# EAGLE design IO4-IR-Detector-GBunza-Fingers (EAGLE 7.7.0)

## Sheet 1 of 16
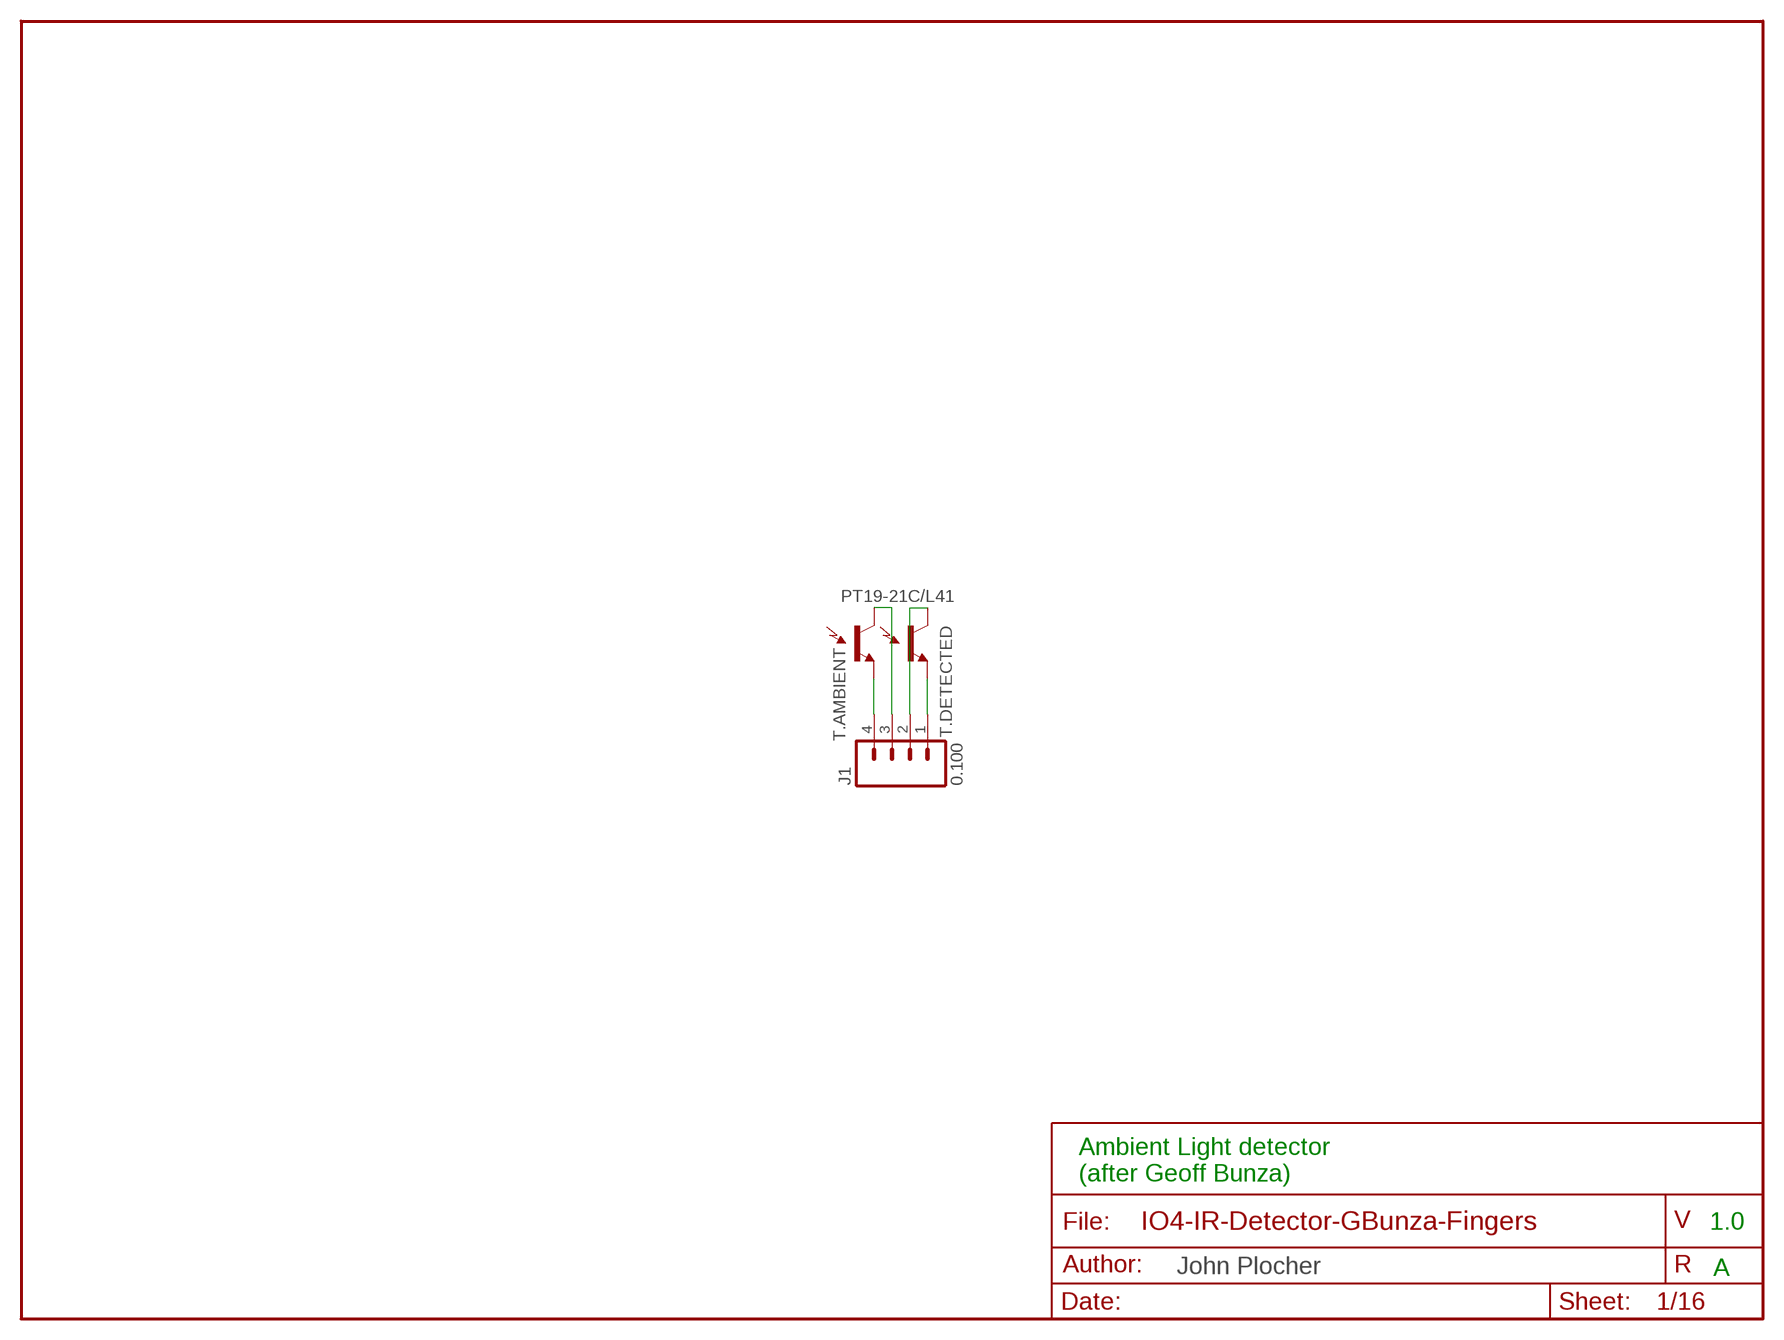
[diagram p0: schematic, sheet 1]

### Parts
J1  0.100  CONNECTOR-M04LOCK  [1X04_LOCK]
T.AMBIENT  PT19-21C/L41  LIGHTSENSORALS  [ALS-PT19]
T.DETECTED  PT19-21C/L41  LIGHTSENSORALS  [ALS-PT19]

### Nets
N$13: J1.4 T.AMBIENT.E(E1)
N$14: J1.1 T.DETECTED.E(E1)
N$15: J1.2 T.DETECTED.C(C1)
N$16: J1.3 T.AMBIENT.C(C1)

### Notes on the sheet
- Ambient Light detector
  (after Geoff Bunza)
- 1.0
- A

## Sheet 2 of 16
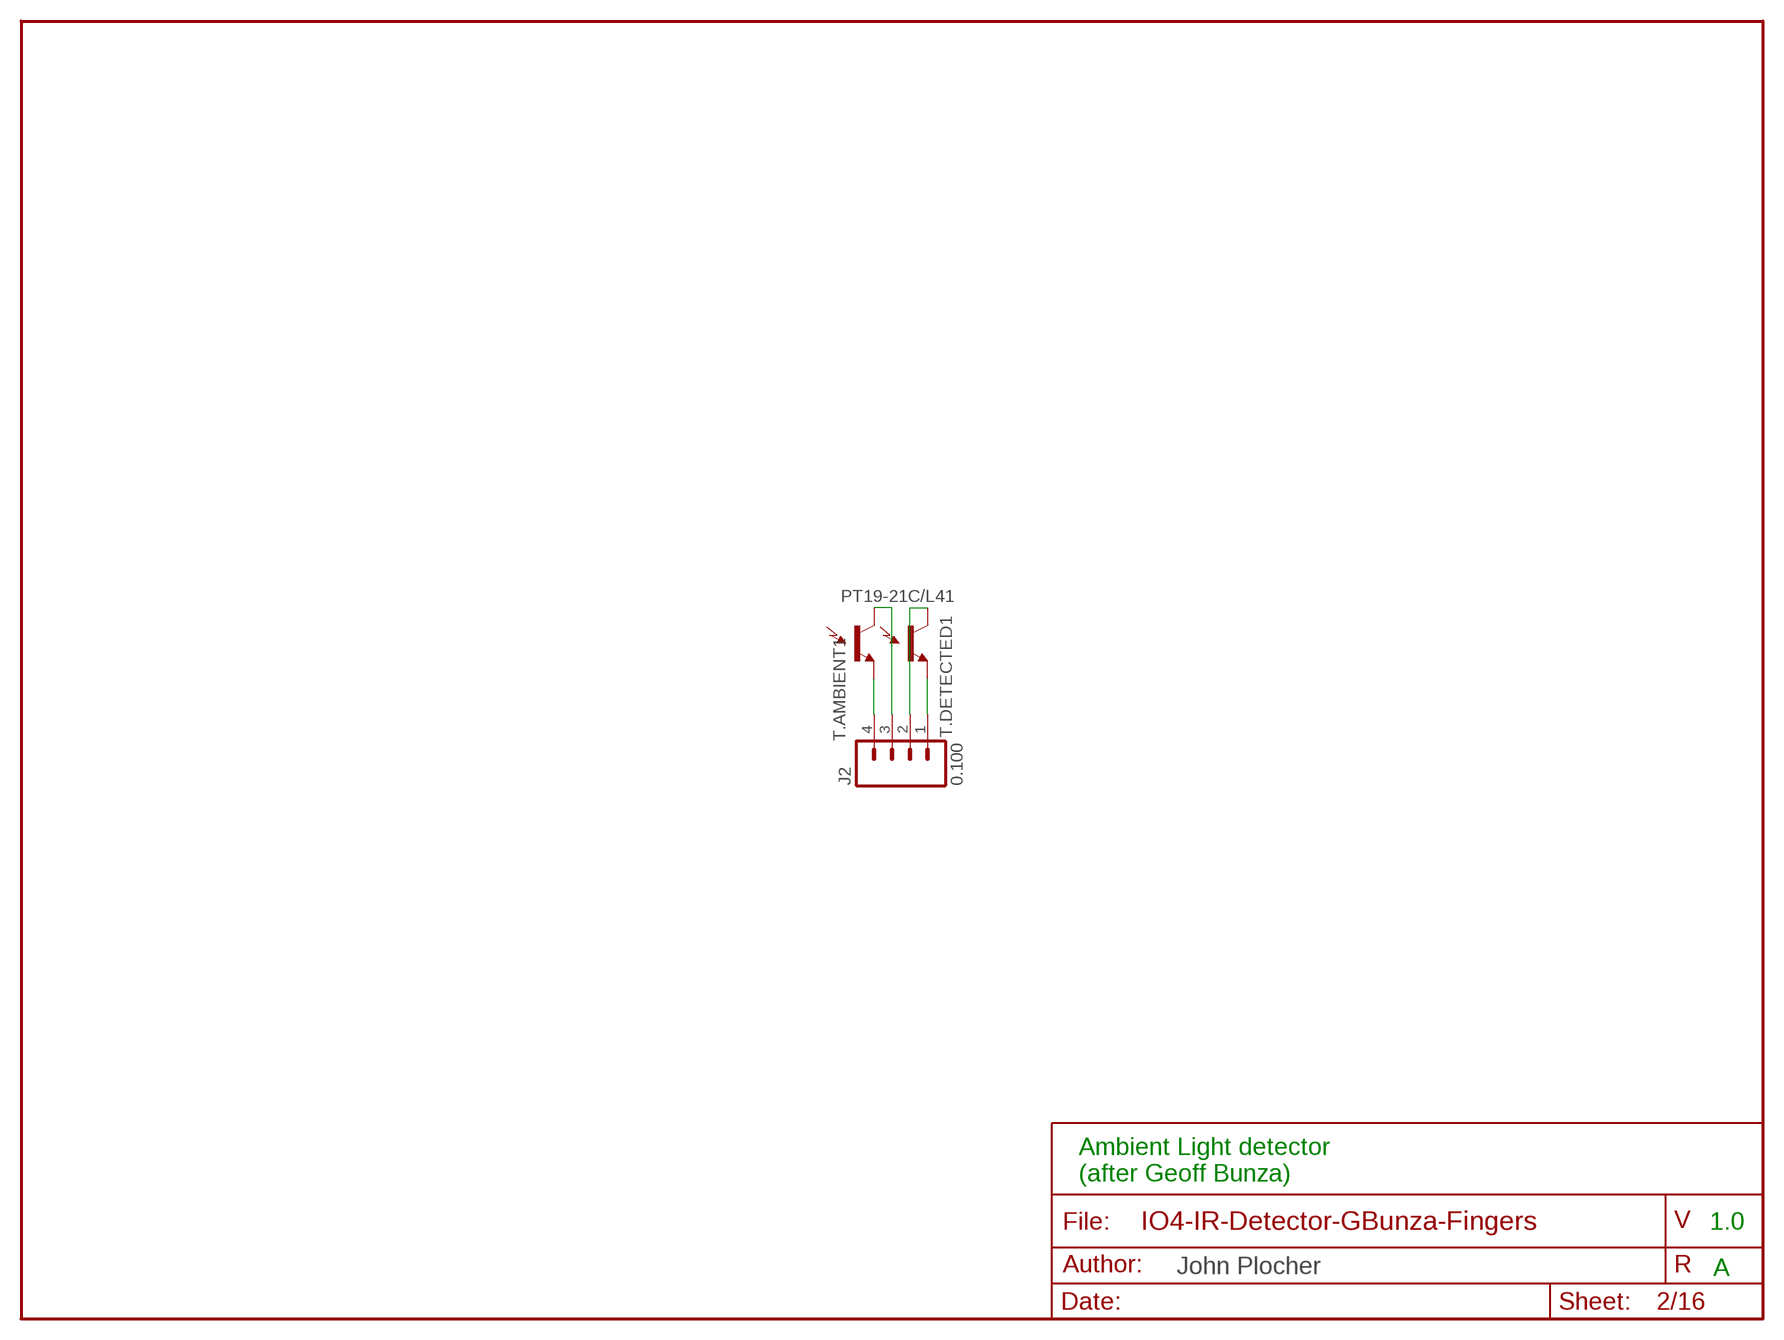
[diagram p1: schematic, sheet 2]

### Parts
J2  0.100  CONNECTOR-M04LOCK  [1X04_LOCK]
T.AMBIENT1  PT19-21C/L41  LIGHTSENSORALS  [ALS-PT19]
T.DETECTED1  PT19-21C/L41  LIGHTSENSORALS  [ALS-PT19]

### Nets
N$1: J2.4 T.AMBIENT1.E(E1)
N$2: J2.1 T.DETECTED1.E(E1)
N$3: J2.2 T.DETECTED1.C(C1)
N$4: J2.3 T.AMBIENT1.C(C1)

### Notes on the sheet
- Ambient Light detector
  (after Geoff Bunza)
- 1.0
- A

## Sheet 3 of 16
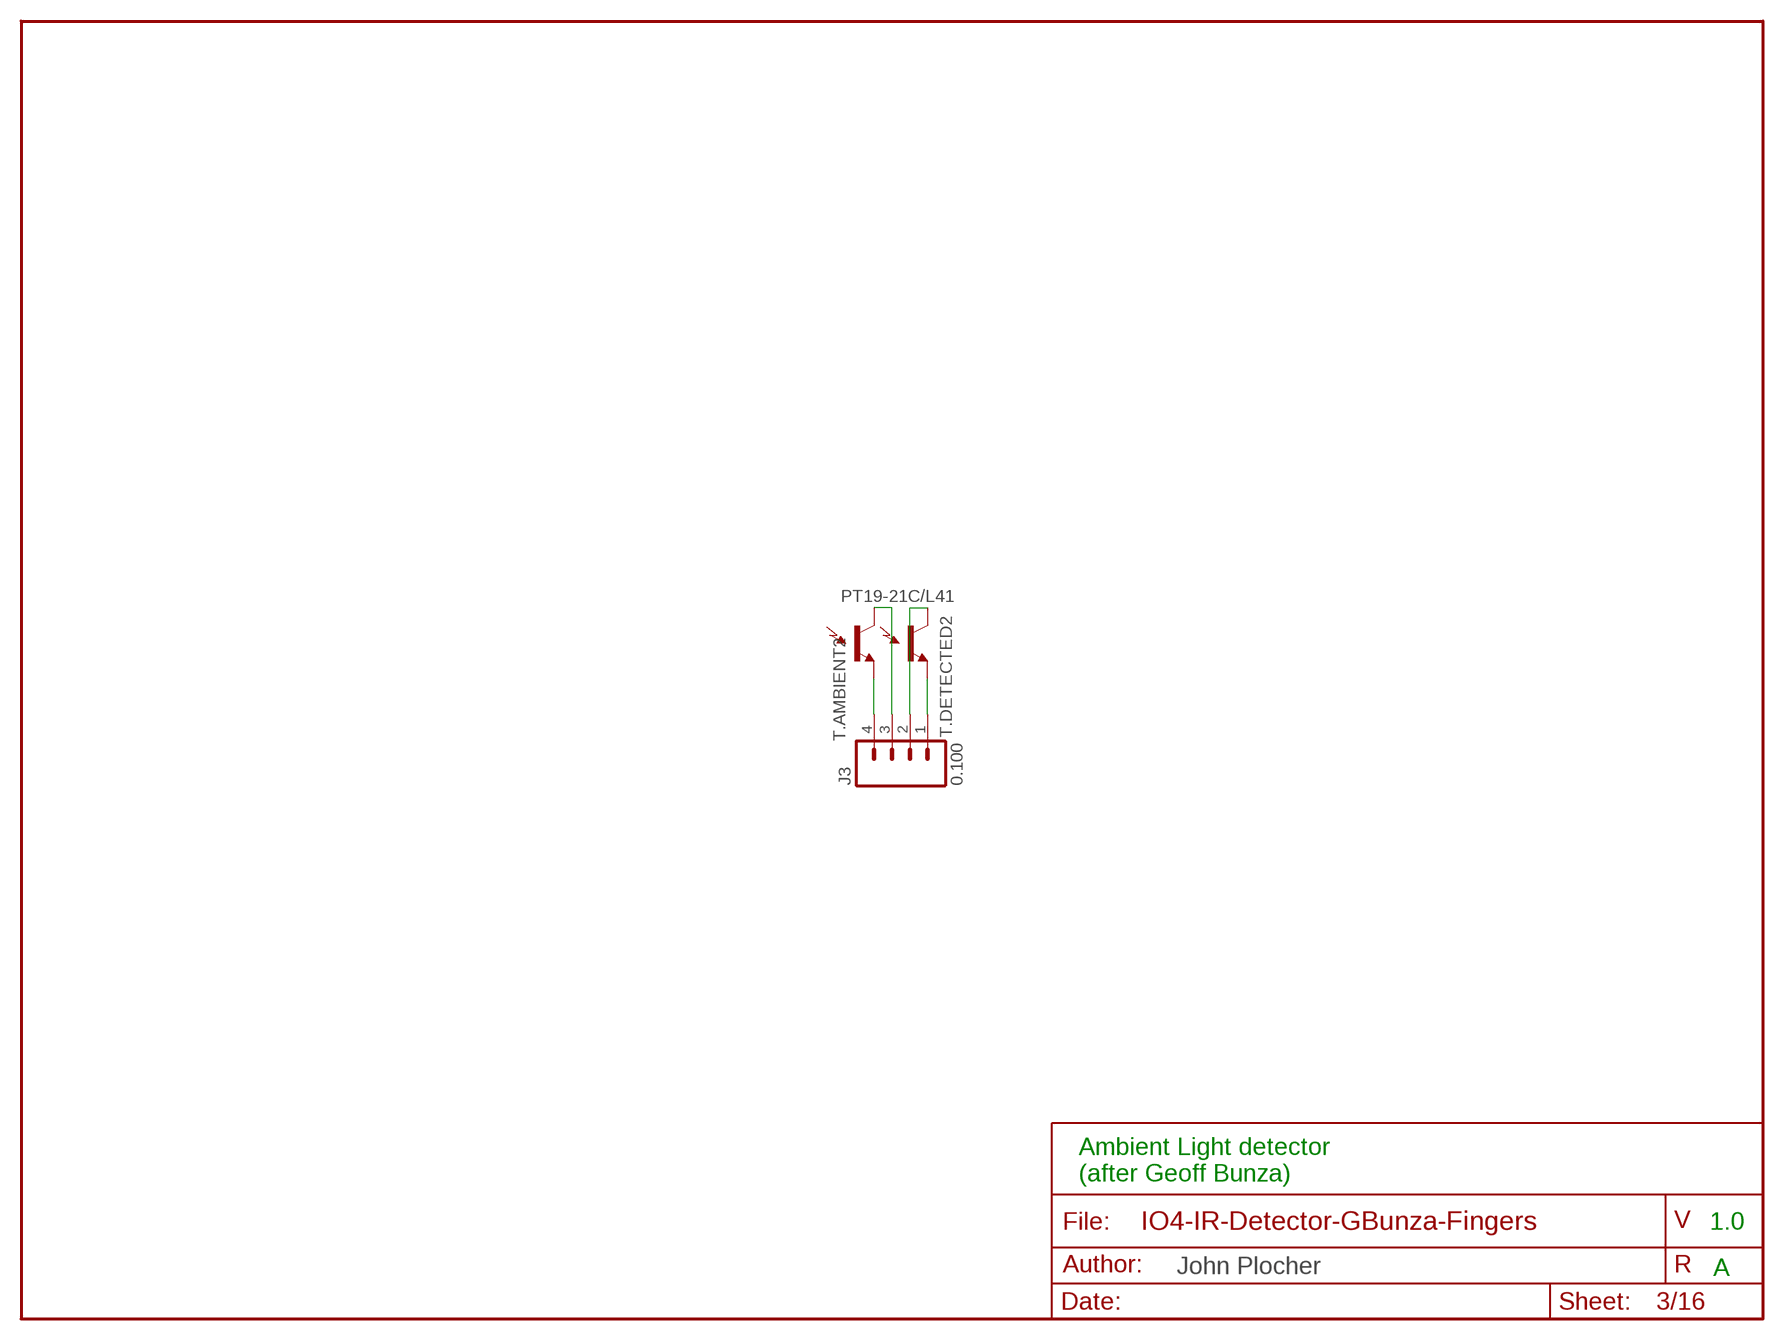
[diagram p2: schematic, sheet 3]

### Parts
J3  0.100  CONNECTOR-M04LOCK  [1X04_LOCK]
T.AMBIENT2  PT19-21C/L41  LIGHTSENSORALS  [ALS-PT19]
T.DETECTED2  PT19-21C/L41  LIGHTSENSORALS  [ALS-PT19]

### Nets
N$5: J3.4 T.AMBIENT2.E(E1)
N$6: J3.1 T.DETECTED2.E(E1)
N$7: J3.2 T.DETECTED2.C(C1)
N$8: J3.3 T.AMBIENT2.C(C1)

### Notes on the sheet
- Ambient Light detector
  (after Geoff Bunza)
- 1.0
- A

## Sheet 4 of 16
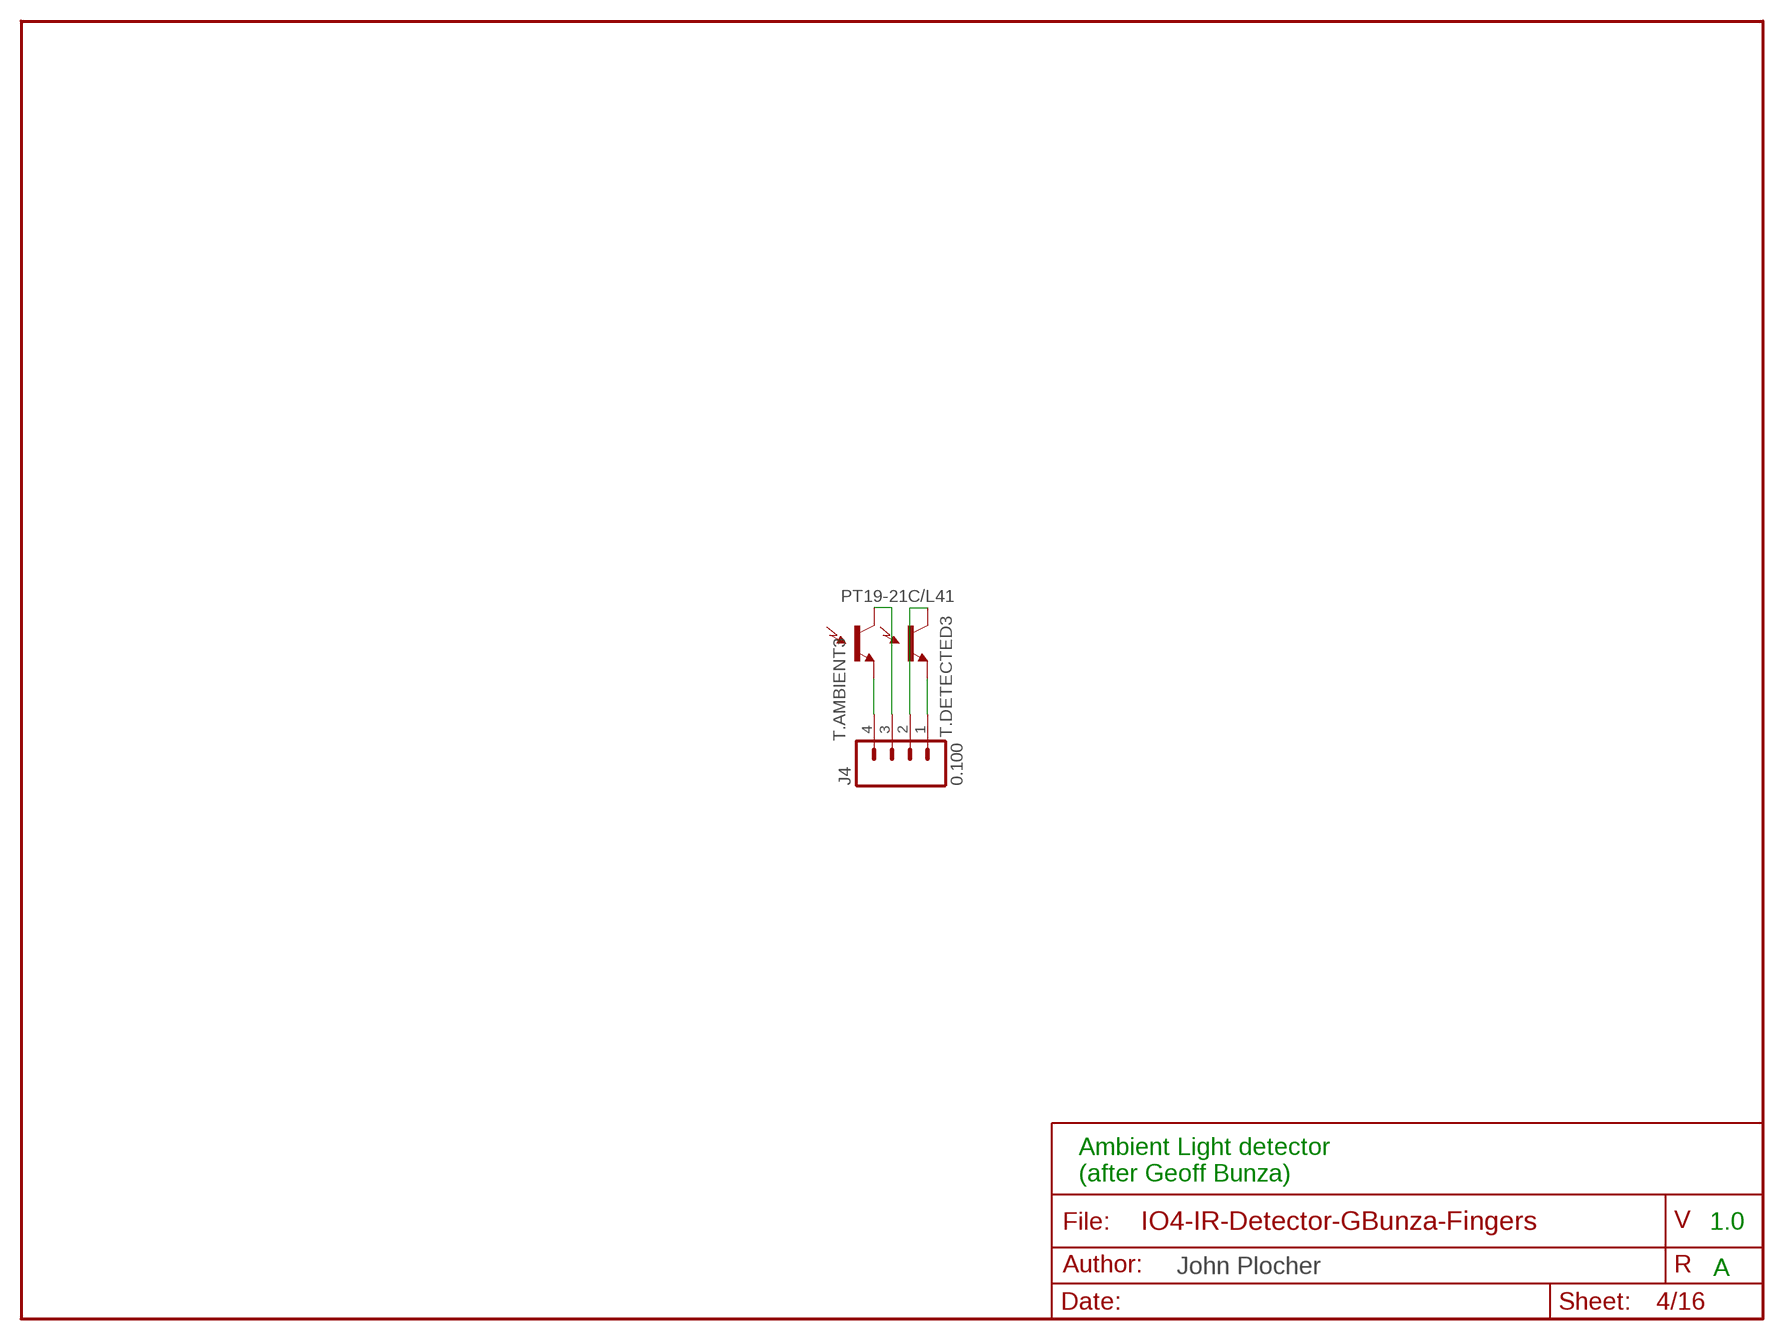
[diagram p3: schematic, sheet 4]

### Parts
J4  0.100  CONNECTOR-M04LOCK  [1X04_LOCK]
T.AMBIENT3  PT19-21C/L41  LIGHTSENSORALS  [ALS-PT19]
T.DETECTED3  PT19-21C/L41  LIGHTSENSORALS  [ALS-PT19]

### Nets
N$9: J4.4 T.AMBIENT3.E(E1)
N$10: J4.1 T.DETECTED3.E(E1)
N$11: J4.2 T.DETECTED3.C(C1)
N$12: J4.3 T.AMBIENT3.C(C1)

### Notes on the sheet
- Ambient Light detector
  (after Geoff Bunza)
- 1.0
- A

## Sheet 5 of 16
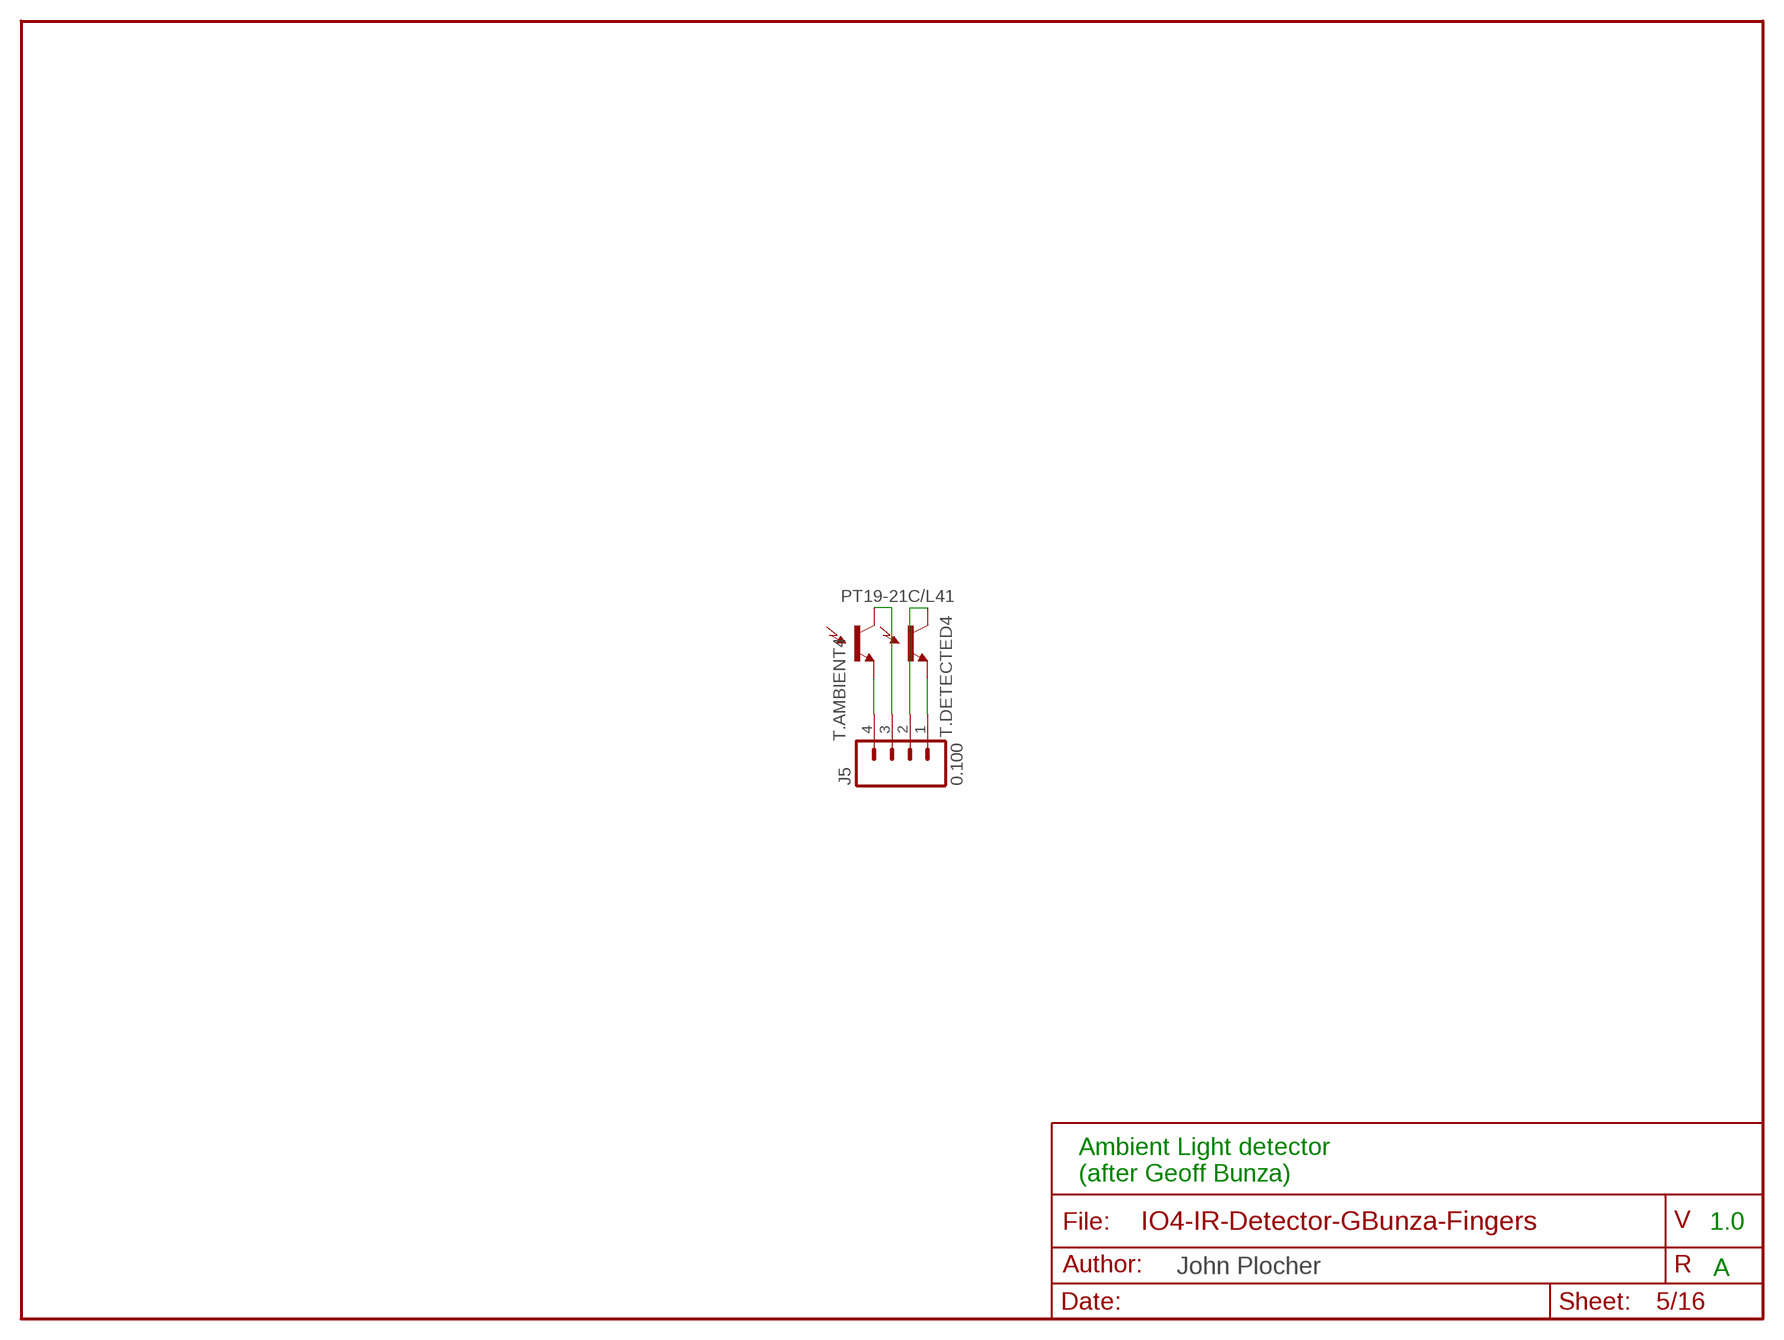
[diagram p4: schematic, sheet 5]

### Parts
J5  0.100  CONNECTOR-M04LOCK  [1X04_LOCK]
T.AMBIENT4  PT19-21C/L41  LIGHTSENSORALS  [ALS-PT19]
T.DETECTED4  PT19-21C/L41  LIGHTSENSORALS  [ALS-PT19]

### Nets
N$17: J5.4 T.AMBIENT4.E(E1)
N$18: J5.1 T.DETECTED4.E(E1)
N$19: J5.2 T.DETECTED4.C(C1)
N$20: J5.3 T.AMBIENT4.C(C1)

### Notes on the sheet
- Ambient Light detector
  (after Geoff Bunza)
- 1.0
- A

## Sheet 6 of 16
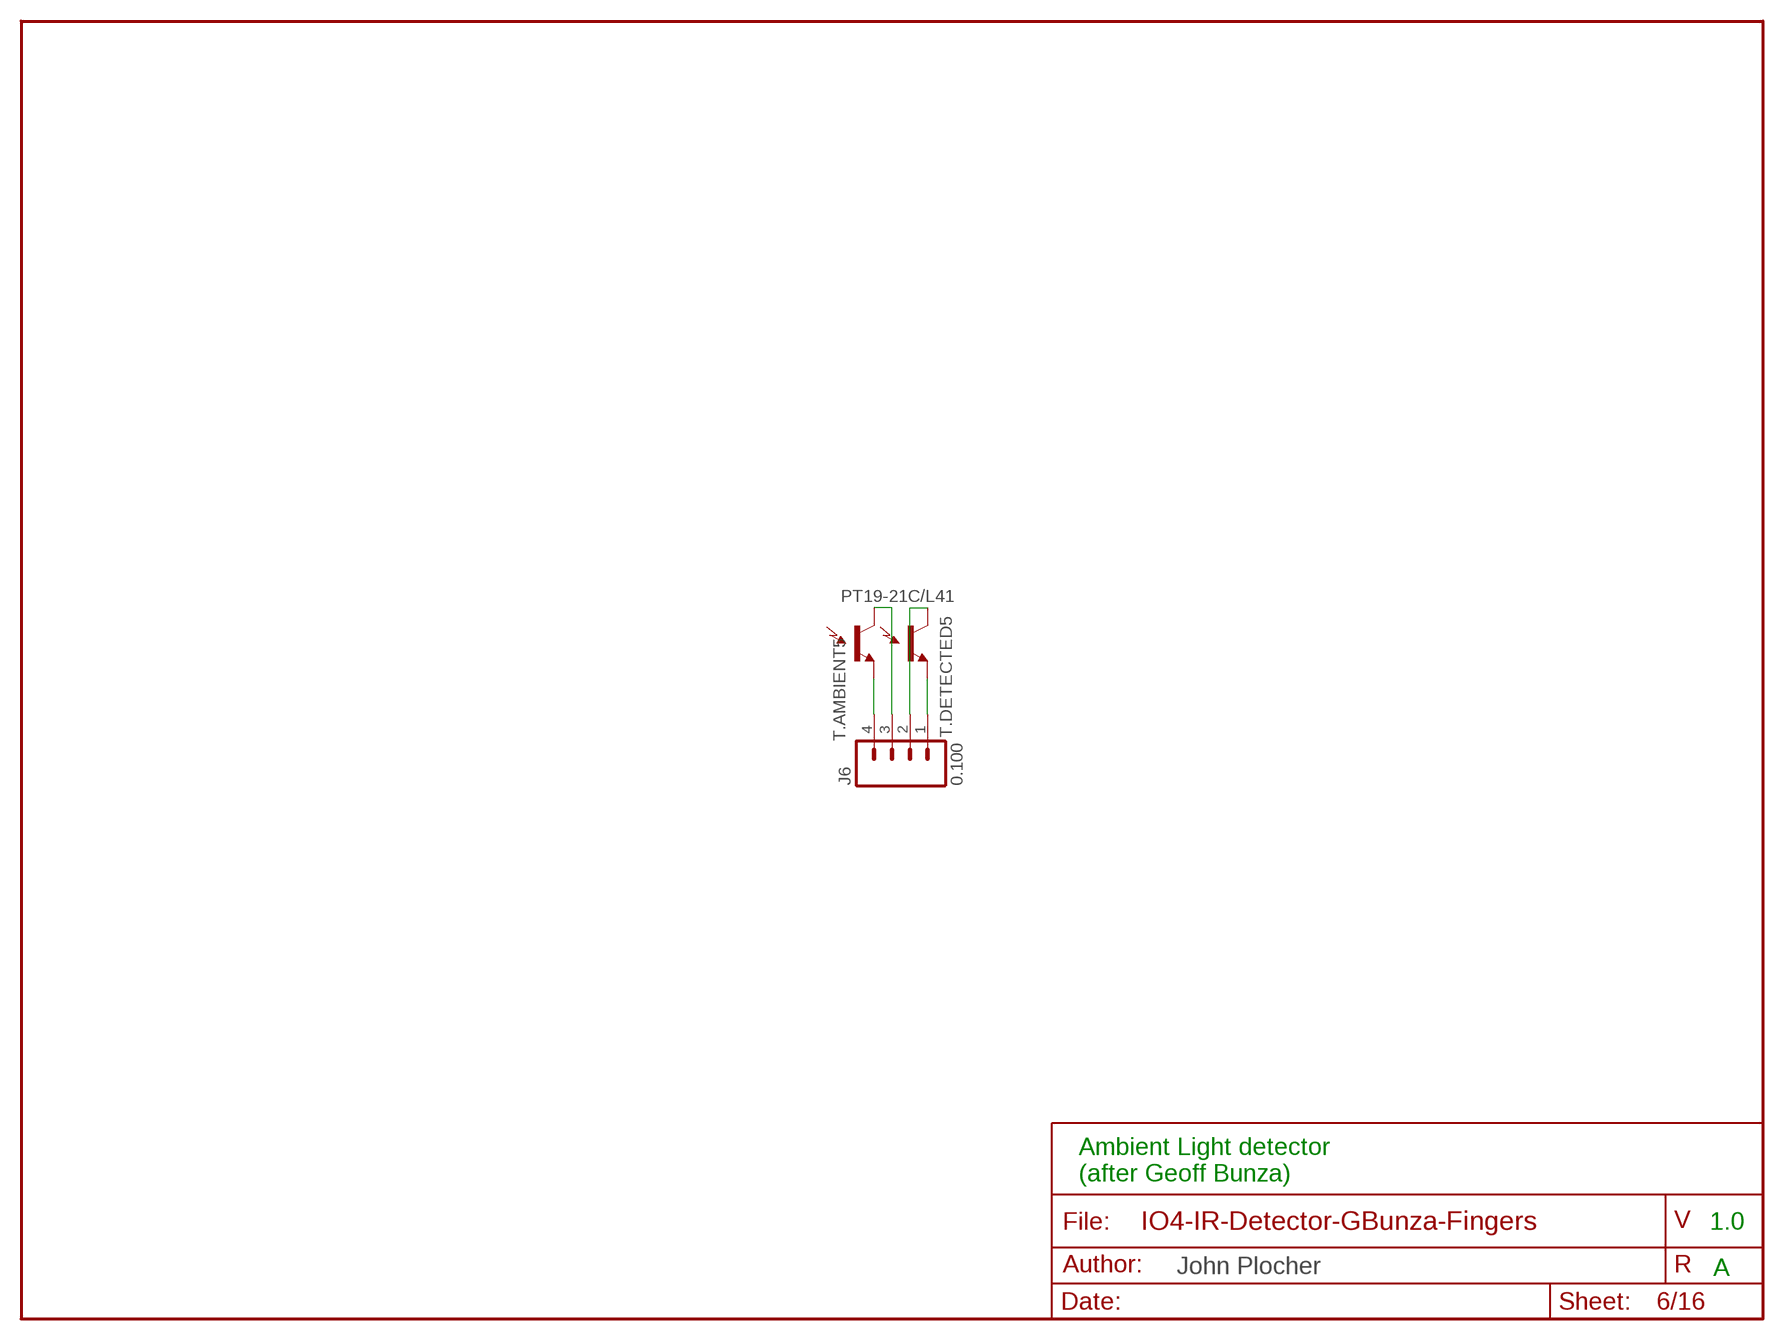
[diagram p5: schematic, sheet 6]

### Parts
J6  0.100  CONNECTOR-M04LOCK  [1X04_LOCK]
T.AMBIENT5  PT19-21C/L41  LIGHTSENSORALS  [ALS-PT19]
T.DETECTED5  PT19-21C/L41  LIGHTSENSORALS  [ALS-PT19]

### Nets
N$21: J6.4 T.AMBIENT5.E(E1)
N$22: J6.1 T.DETECTED5.E(E1)
N$23: J6.2 T.DETECTED5.C(C1)
N$24: J6.3 T.AMBIENT5.C(C1)

### Notes on the sheet
- Ambient Light detector
  (after Geoff Bunza)
- 1.0
- A

## Sheet 7 of 16
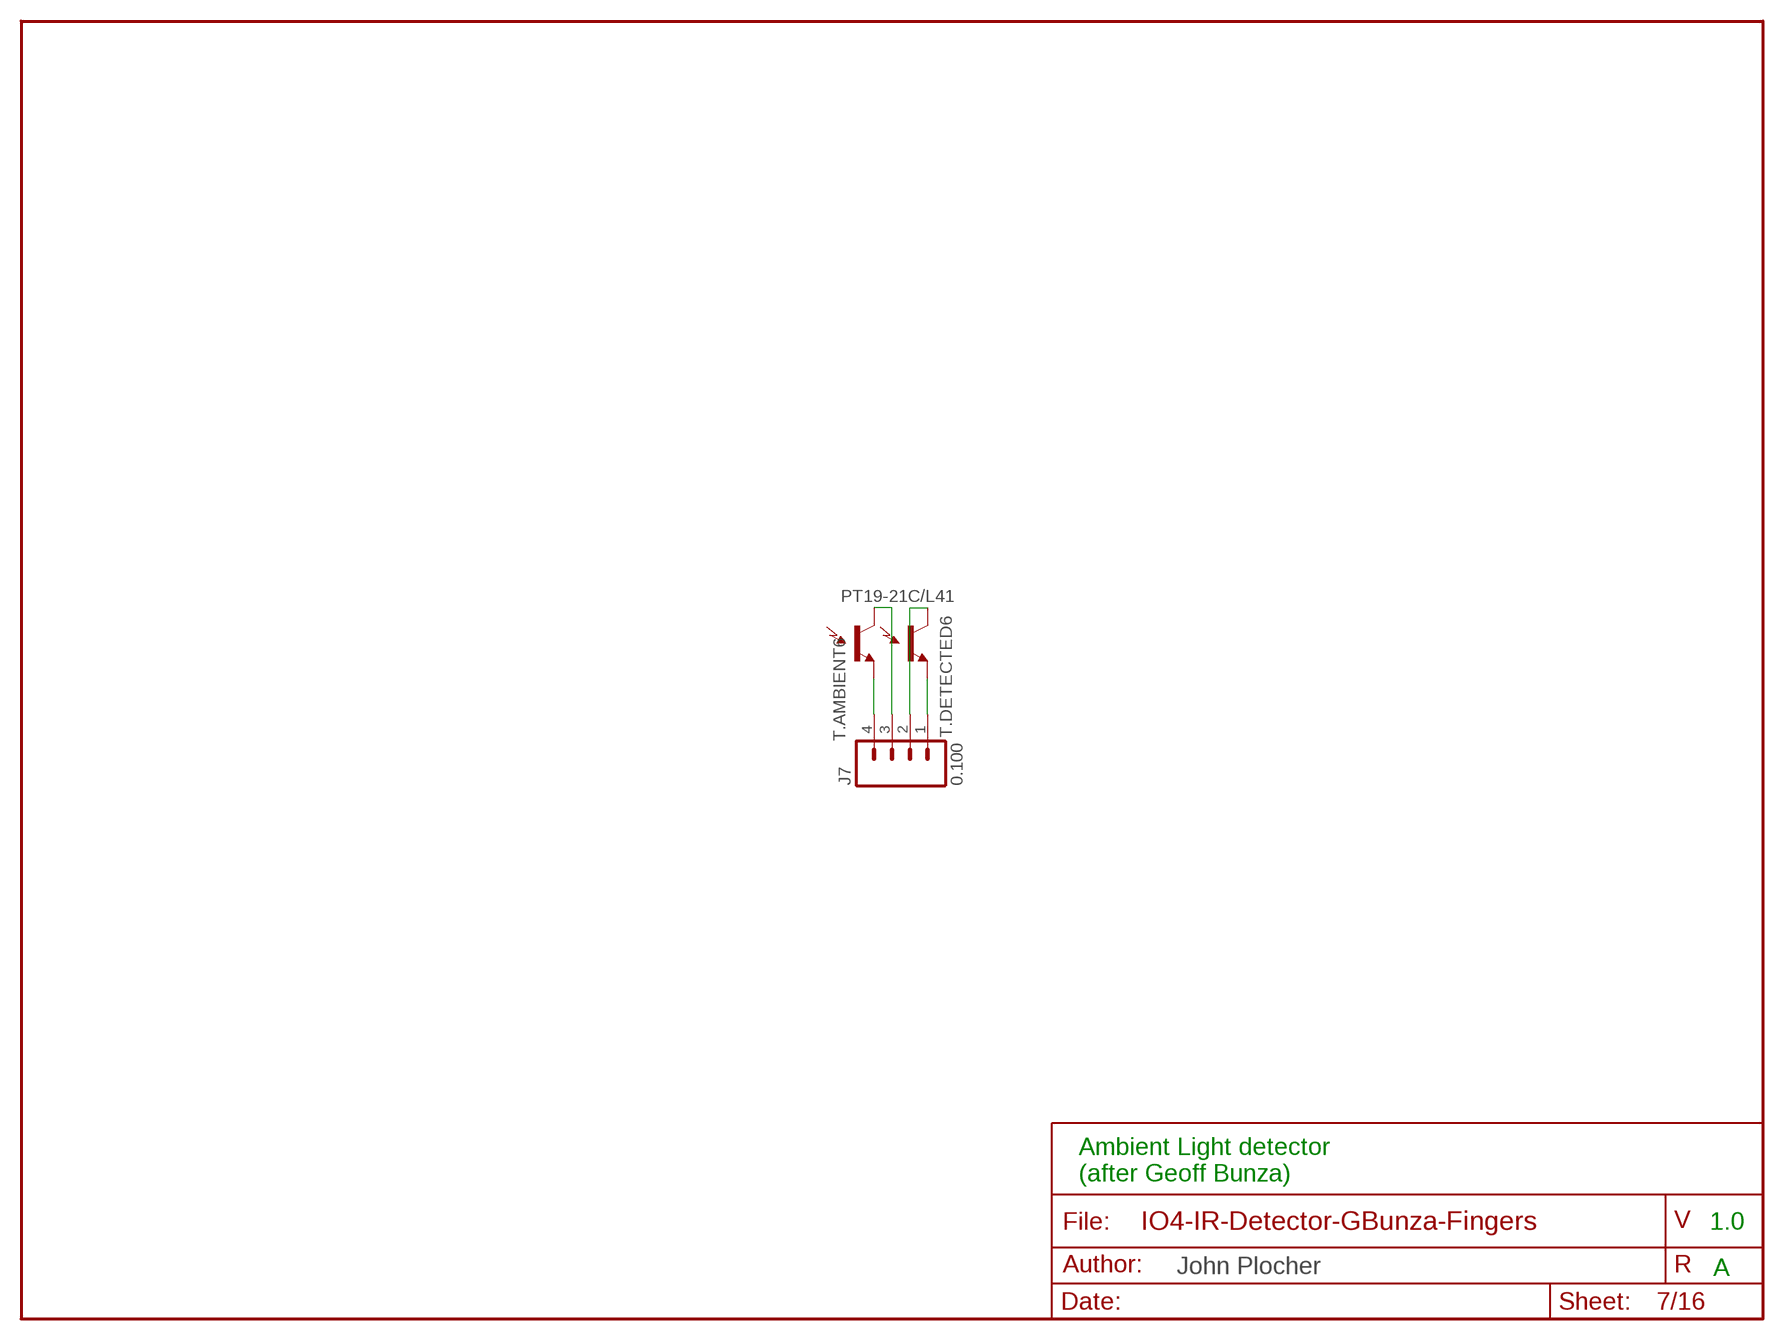
[diagram p6: schematic, sheet 7]

### Parts
J7  0.100  CONNECTOR-M04LOCK  [1X04_LOCK]
T.AMBIENT6  PT19-21C/L41  LIGHTSENSORALS  [ALS-PT19]
T.DETECTED6  PT19-21C/L41  LIGHTSENSORALS  [ALS-PT19]

### Nets
N$25: J7.4 T.AMBIENT6.E(E1)
N$26: J7.1 T.DETECTED6.E(E1)
N$27: J7.2 T.DETECTED6.C(C1)
N$28: J7.3 T.AMBIENT6.C(C1)

### Notes on the sheet
- Ambient Light detector
  (after Geoff Bunza)
- 1.0
- A

## Sheet 8 of 16
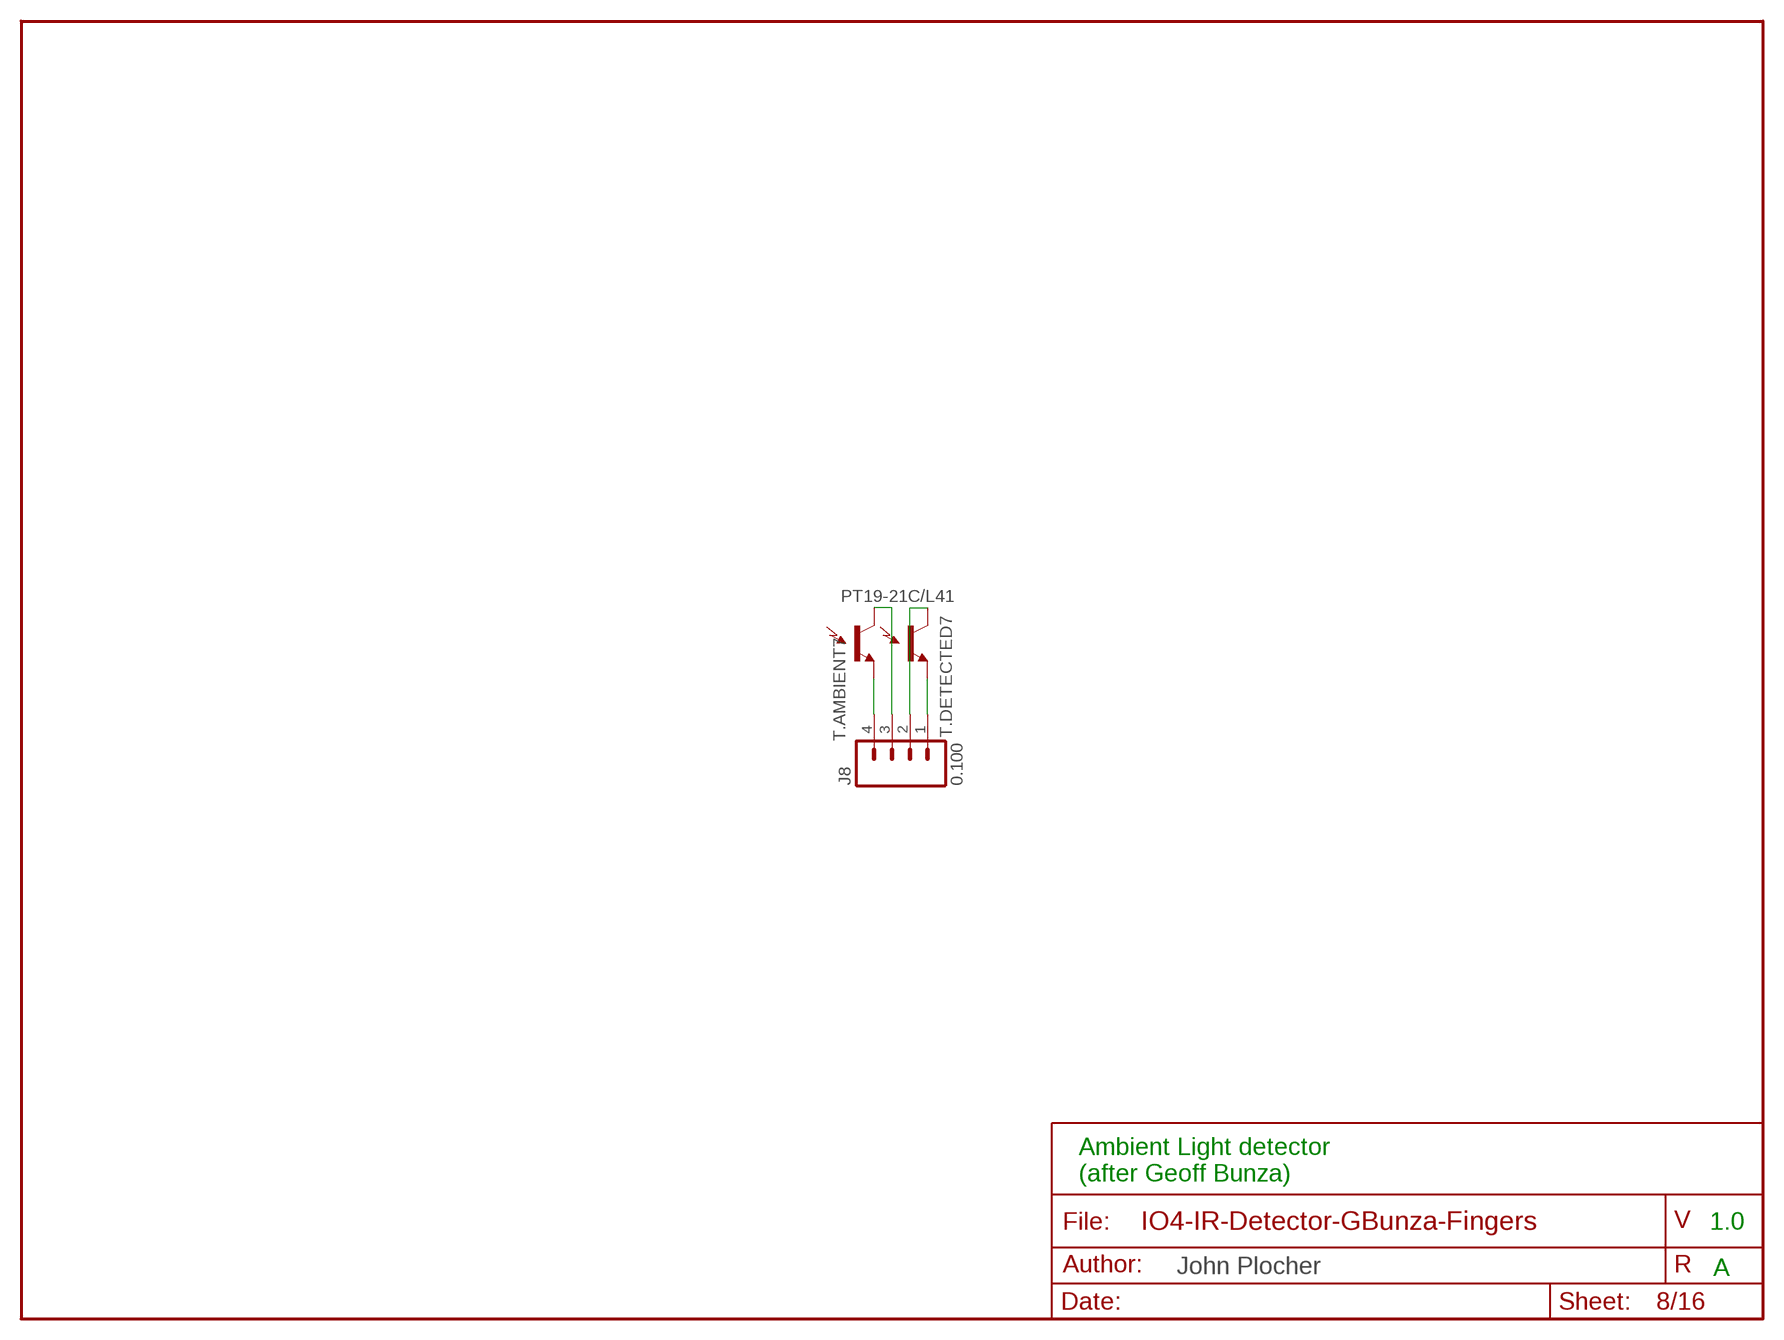
[diagram p7: schematic, sheet 8]

### Parts
J8  0.100  CONNECTOR-M04LOCK  [1X04_LOCK]
T.AMBIENT7  PT19-21C/L41  LIGHTSENSORALS  [ALS-PT19]
T.DETECTED7  PT19-21C/L41  LIGHTSENSORALS  [ALS-PT19]

### Nets
N$29: J8.4 T.AMBIENT7.E(E1)
N$30: J8.1 T.DETECTED7.E(E1)
N$31: J8.2 T.DETECTED7.C(C1)
N$32: J8.3 T.AMBIENT7.C(C1)

### Notes on the sheet
- Ambient Light detector
  (after Geoff Bunza)
- 1.0
- A

## Sheet 9 of 16
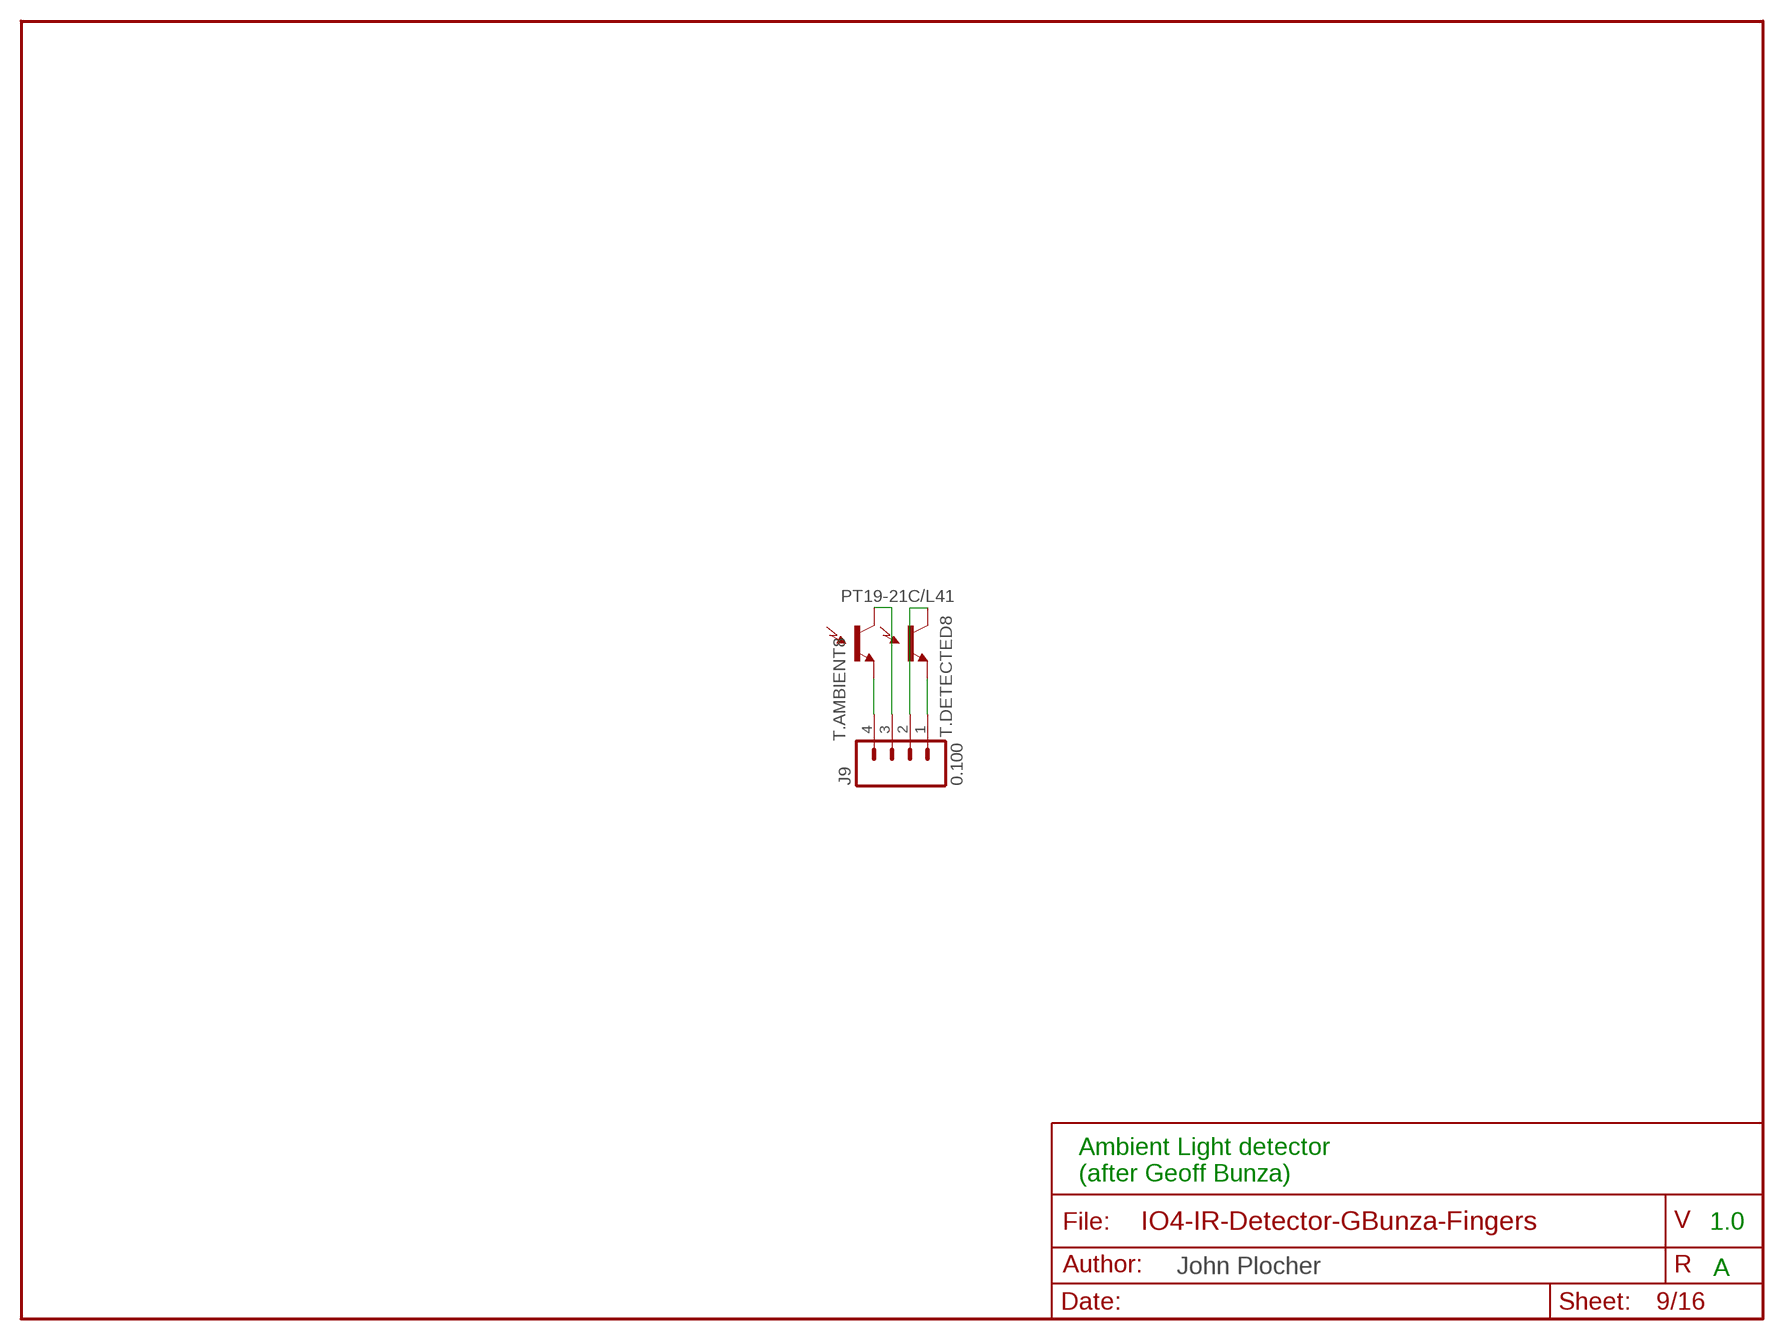
[diagram p8: schematic, sheet 9]

### Parts
J9  0.100  CONNECTOR-M04LOCK  [1X04_LOCK]
T.AMBIENT8  PT19-21C/L41  LIGHTSENSORALS  [ALS-PT19]
T.DETECTED8  PT19-21C/L41  LIGHTSENSORALS  [ALS-PT19]

### Nets
N$33: J9.4 T.AMBIENT8.E(E1)
N$34: J9.1 T.DETECTED8.E(E1)
N$35: J9.2 T.DETECTED8.C(C1)
N$36: J9.3 T.AMBIENT8.C(C1)

### Notes on the sheet
- Ambient Light detector
  (after Geoff Bunza)
- 1.0
- A

## Sheet 10 of 16
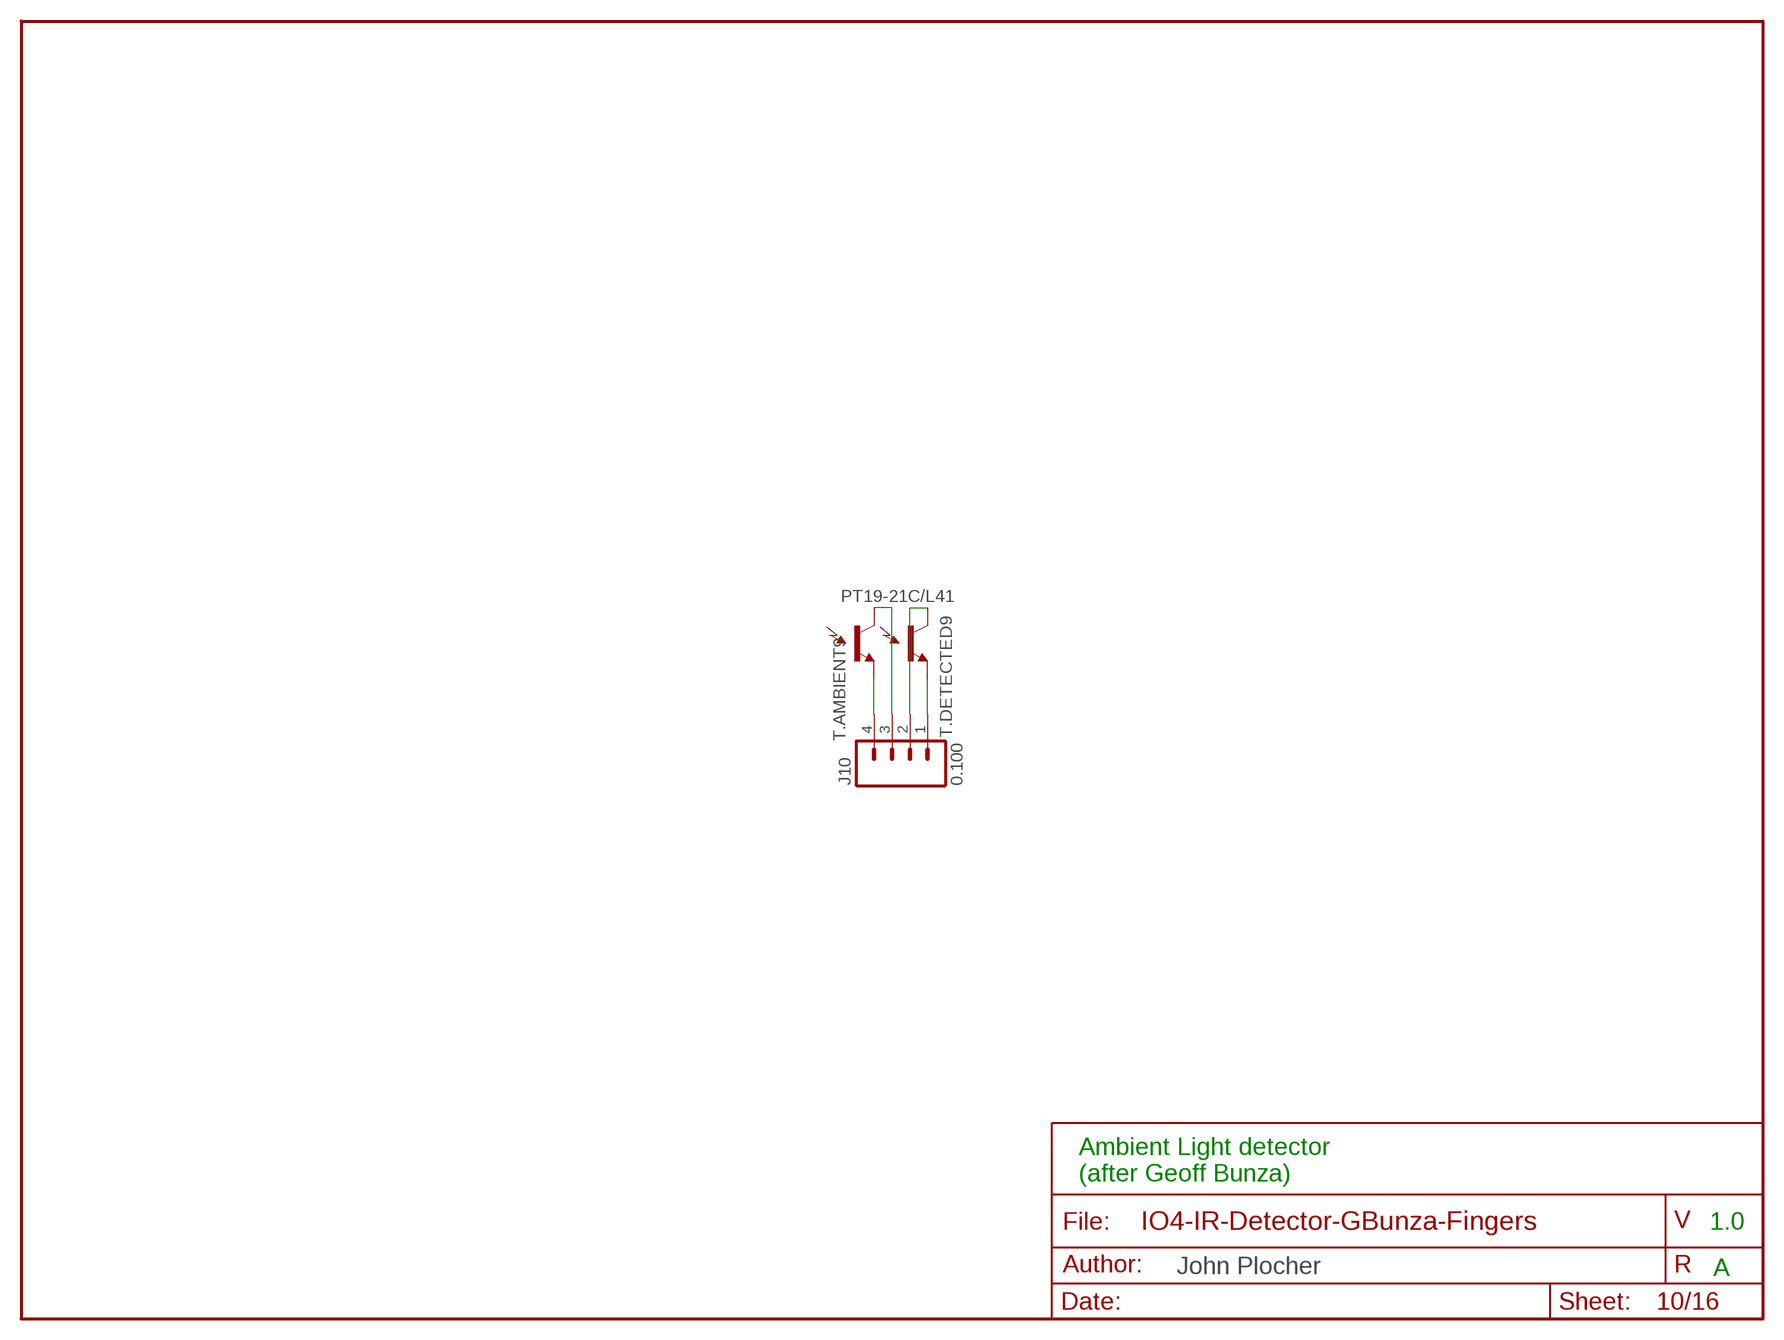
[diagram p9: schematic, sheet 10]

### Parts
J10  0.100  CONNECTOR-M04LOCK  [1X04_LOCK]
T.AMBIENT9  PT19-21C/L41  LIGHTSENSORALS  [ALS-PT19]
T.DETECTED9  PT19-21C/L41  LIGHTSENSORALS  [ALS-PT19]

### Nets
N$37: J10.4 T.AMBIENT9.E(E1)
N$38: J10.1 T.DETECTED9.E(E1)
N$39: J10.2 T.DETECTED9.C(C1)
N$40: J10.3 T.AMBIENT9.C(C1)

### Notes on the sheet
- Ambient Light detector
  (after Geoff Bunza)
- 1.0
- A

## Sheet 11 of 16
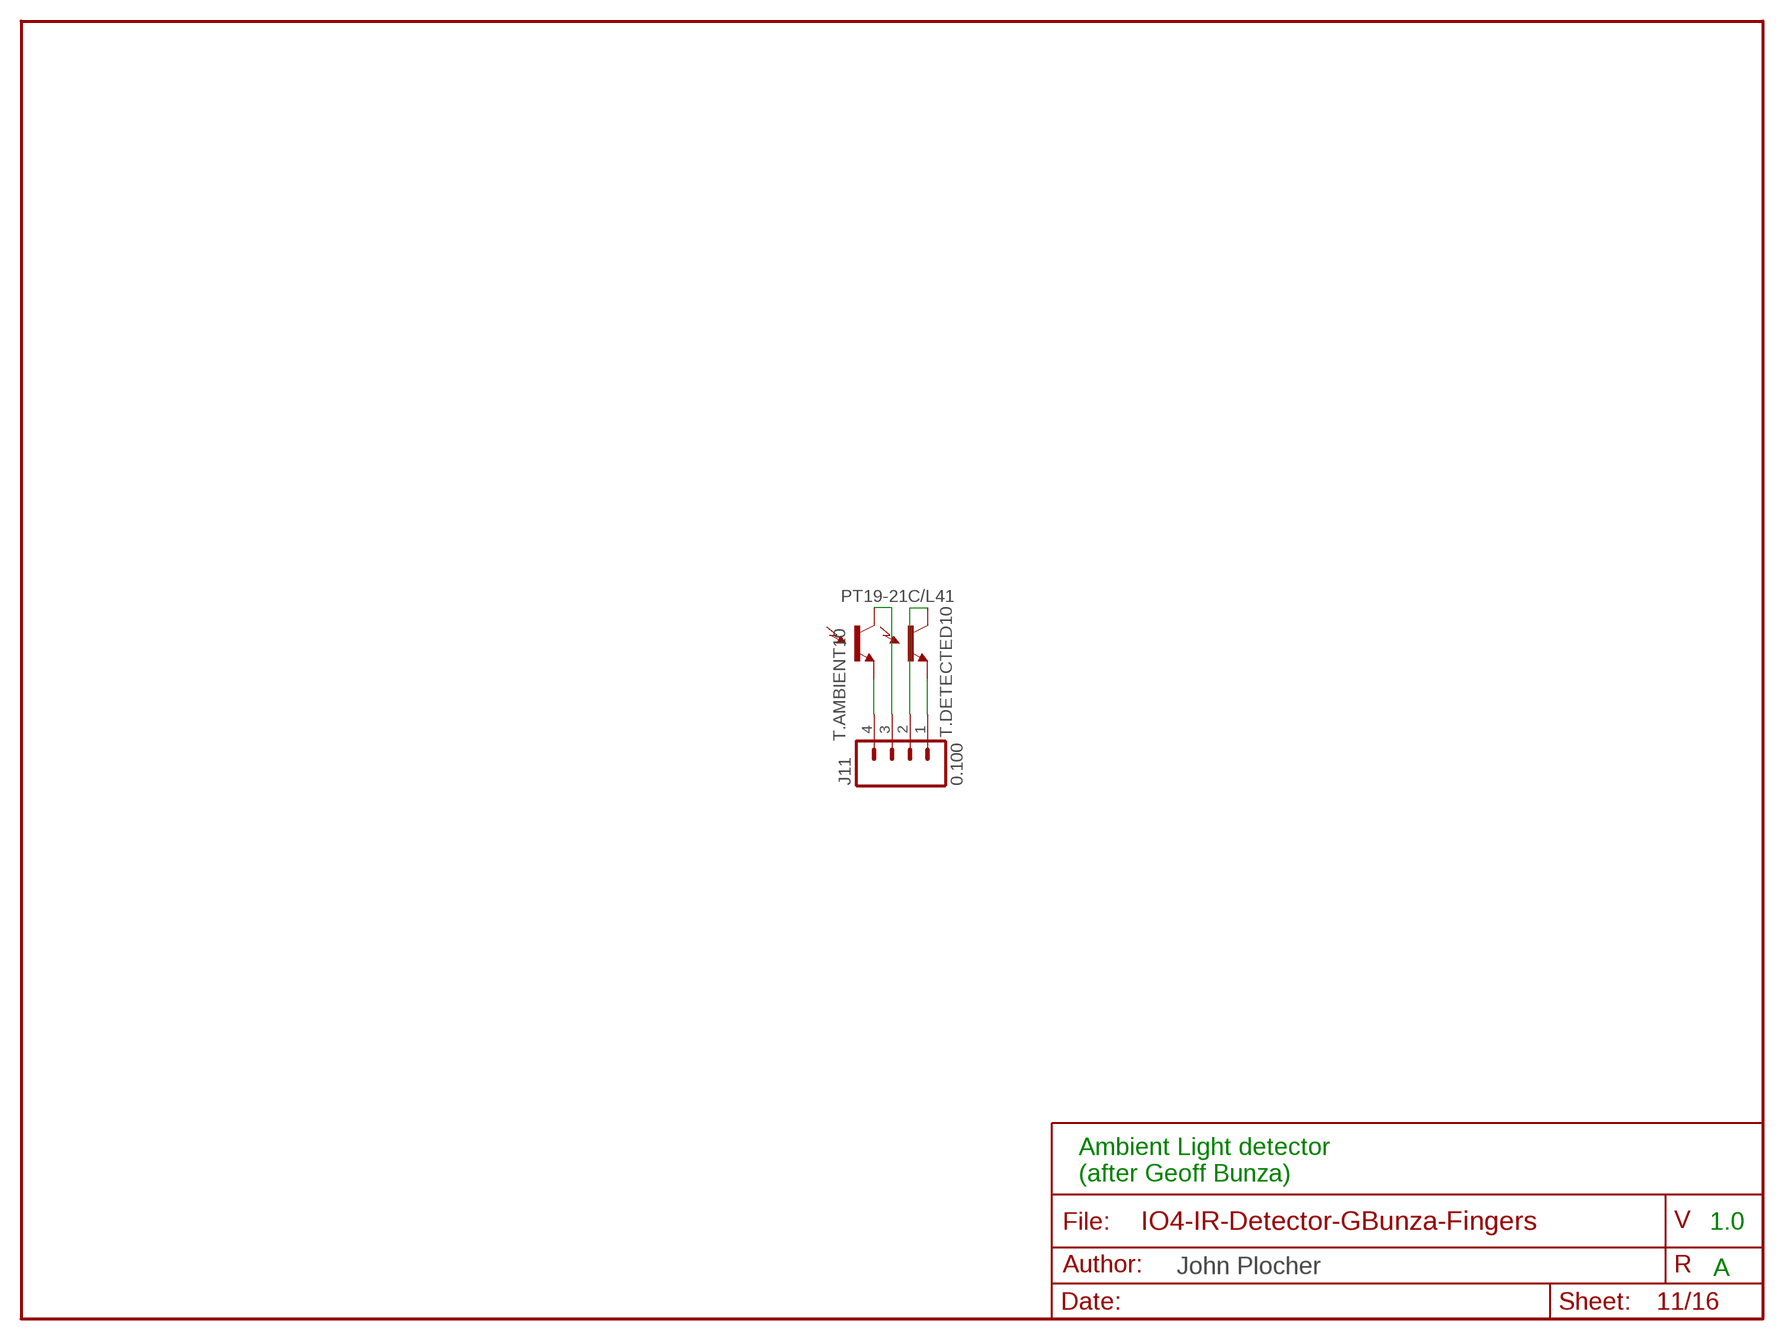
[diagram p10: schematic, sheet 11]

### Parts
J11  0.100  CONNECTOR-M04LOCK  [1X04_LOCK]
T.AMBIENT10  PT19-21C/L41  LIGHTSENSORALS  [ALS-PT19]
T.DETECTED10  PT19-21C/L41  LIGHTSENSORALS  [ALS-PT19]

### Nets
N$41: J11.4 T.AMBIENT10.E(E1)
N$42: J11.1 T.DETECTED10.E(E1)
N$43: J11.2 T.DETECTED10.C(C1)
N$44: J11.3 T.AMBIENT10.C(C1)

### Notes on the sheet
- Ambient Light detector
  (after Geoff Bunza)
- 1.0
- A

## Sheet 12 of 16
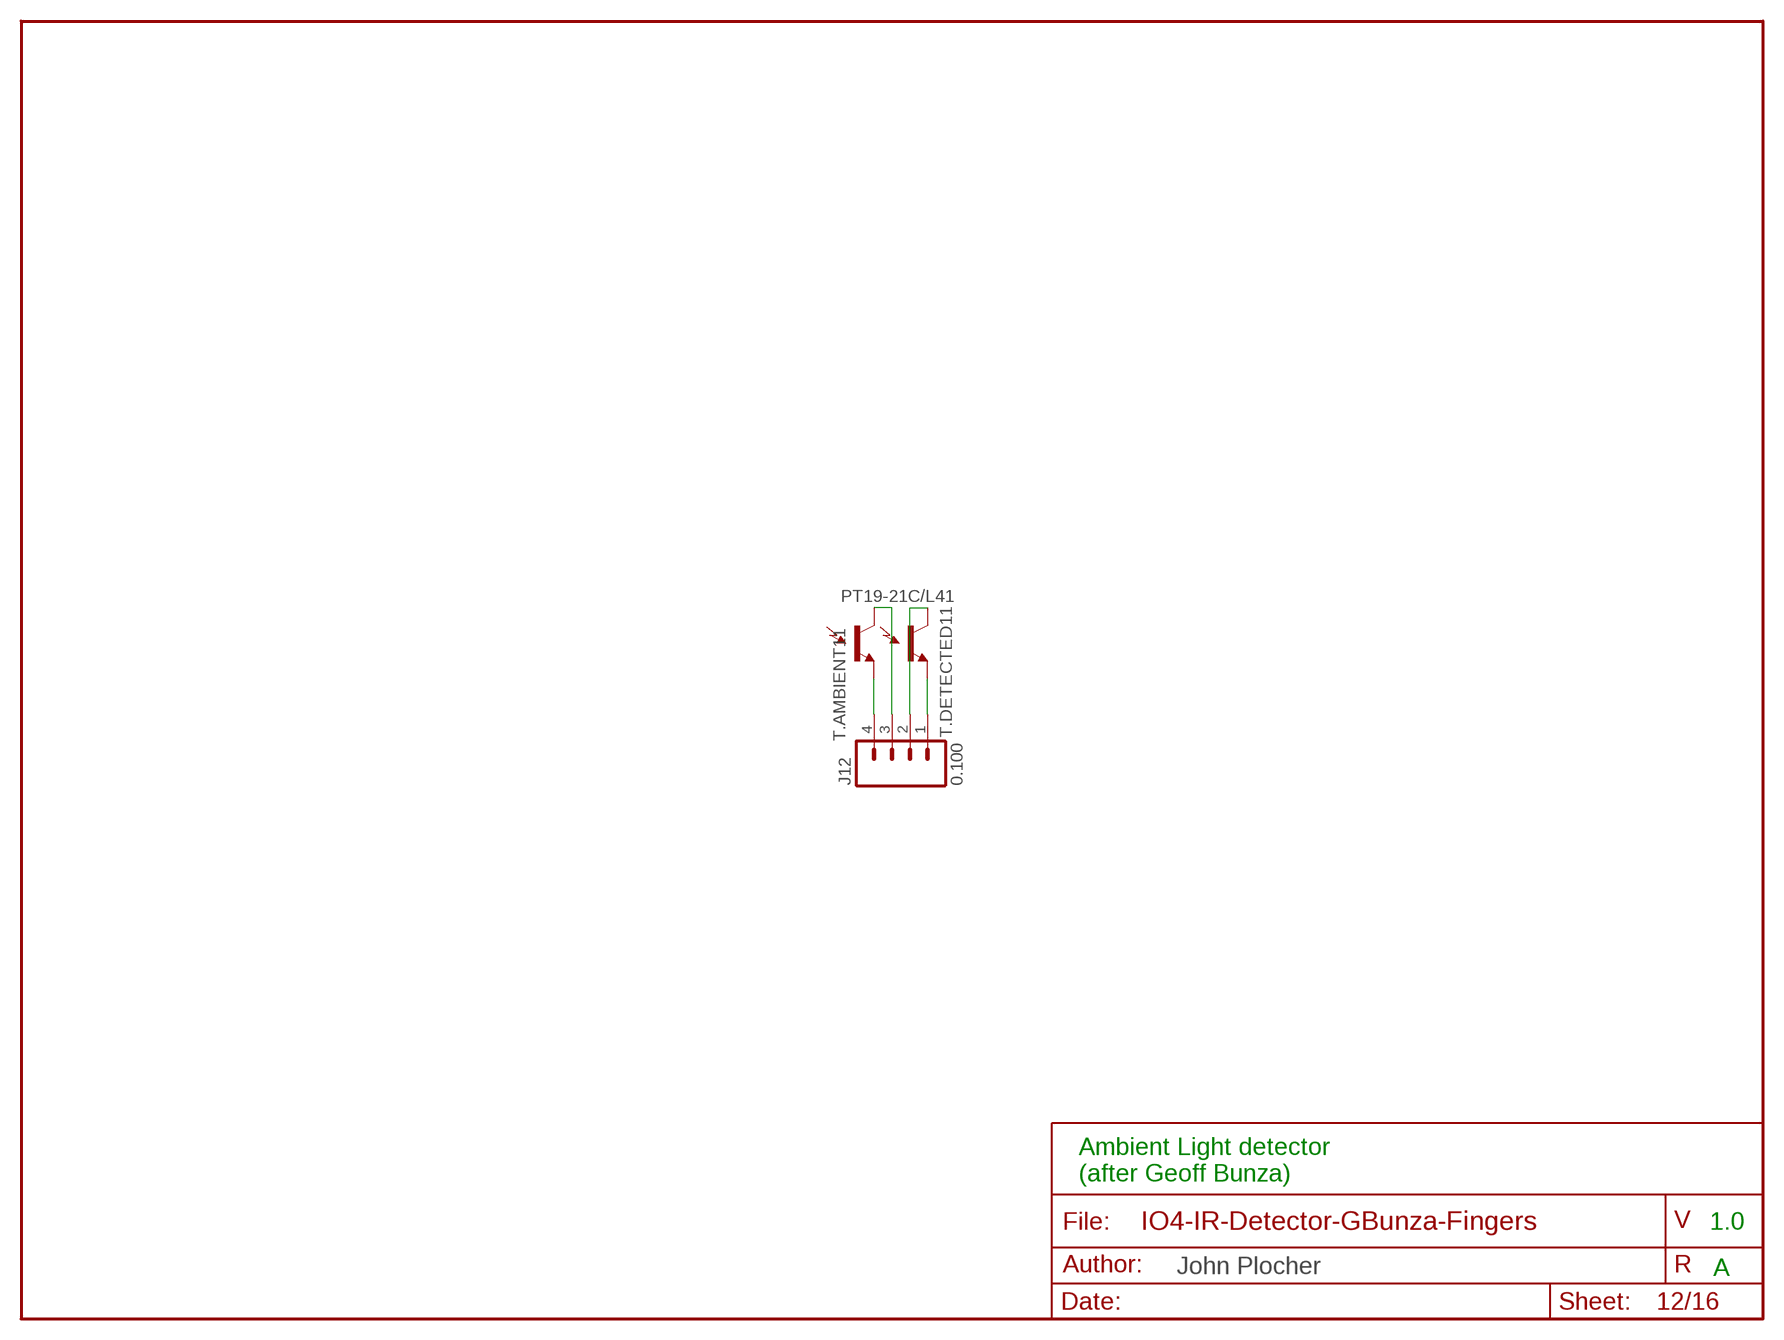
[diagram p11: schematic, sheet 12]

### Parts
J12  0.100  CONNECTOR-M04LOCK  [1X04_LOCK]
T.AMBIENT11  PT19-21C/L41  LIGHTSENSORALS  [ALS-PT19]
T.DETECTED11  PT19-21C/L41  LIGHTSENSORALS  [ALS-PT19]

### Nets
N$45: J12.4 T.AMBIENT11.E(E1)
N$46: J12.1 T.DETECTED11.E(E1)
N$47: J12.2 T.DETECTED11.C(C1)
N$48: J12.3 T.AMBIENT11.C(C1)

### Notes on the sheet
- Ambient Light detector
  (after Geoff Bunza)
- 1.0
- A

## Sheet 13 of 16
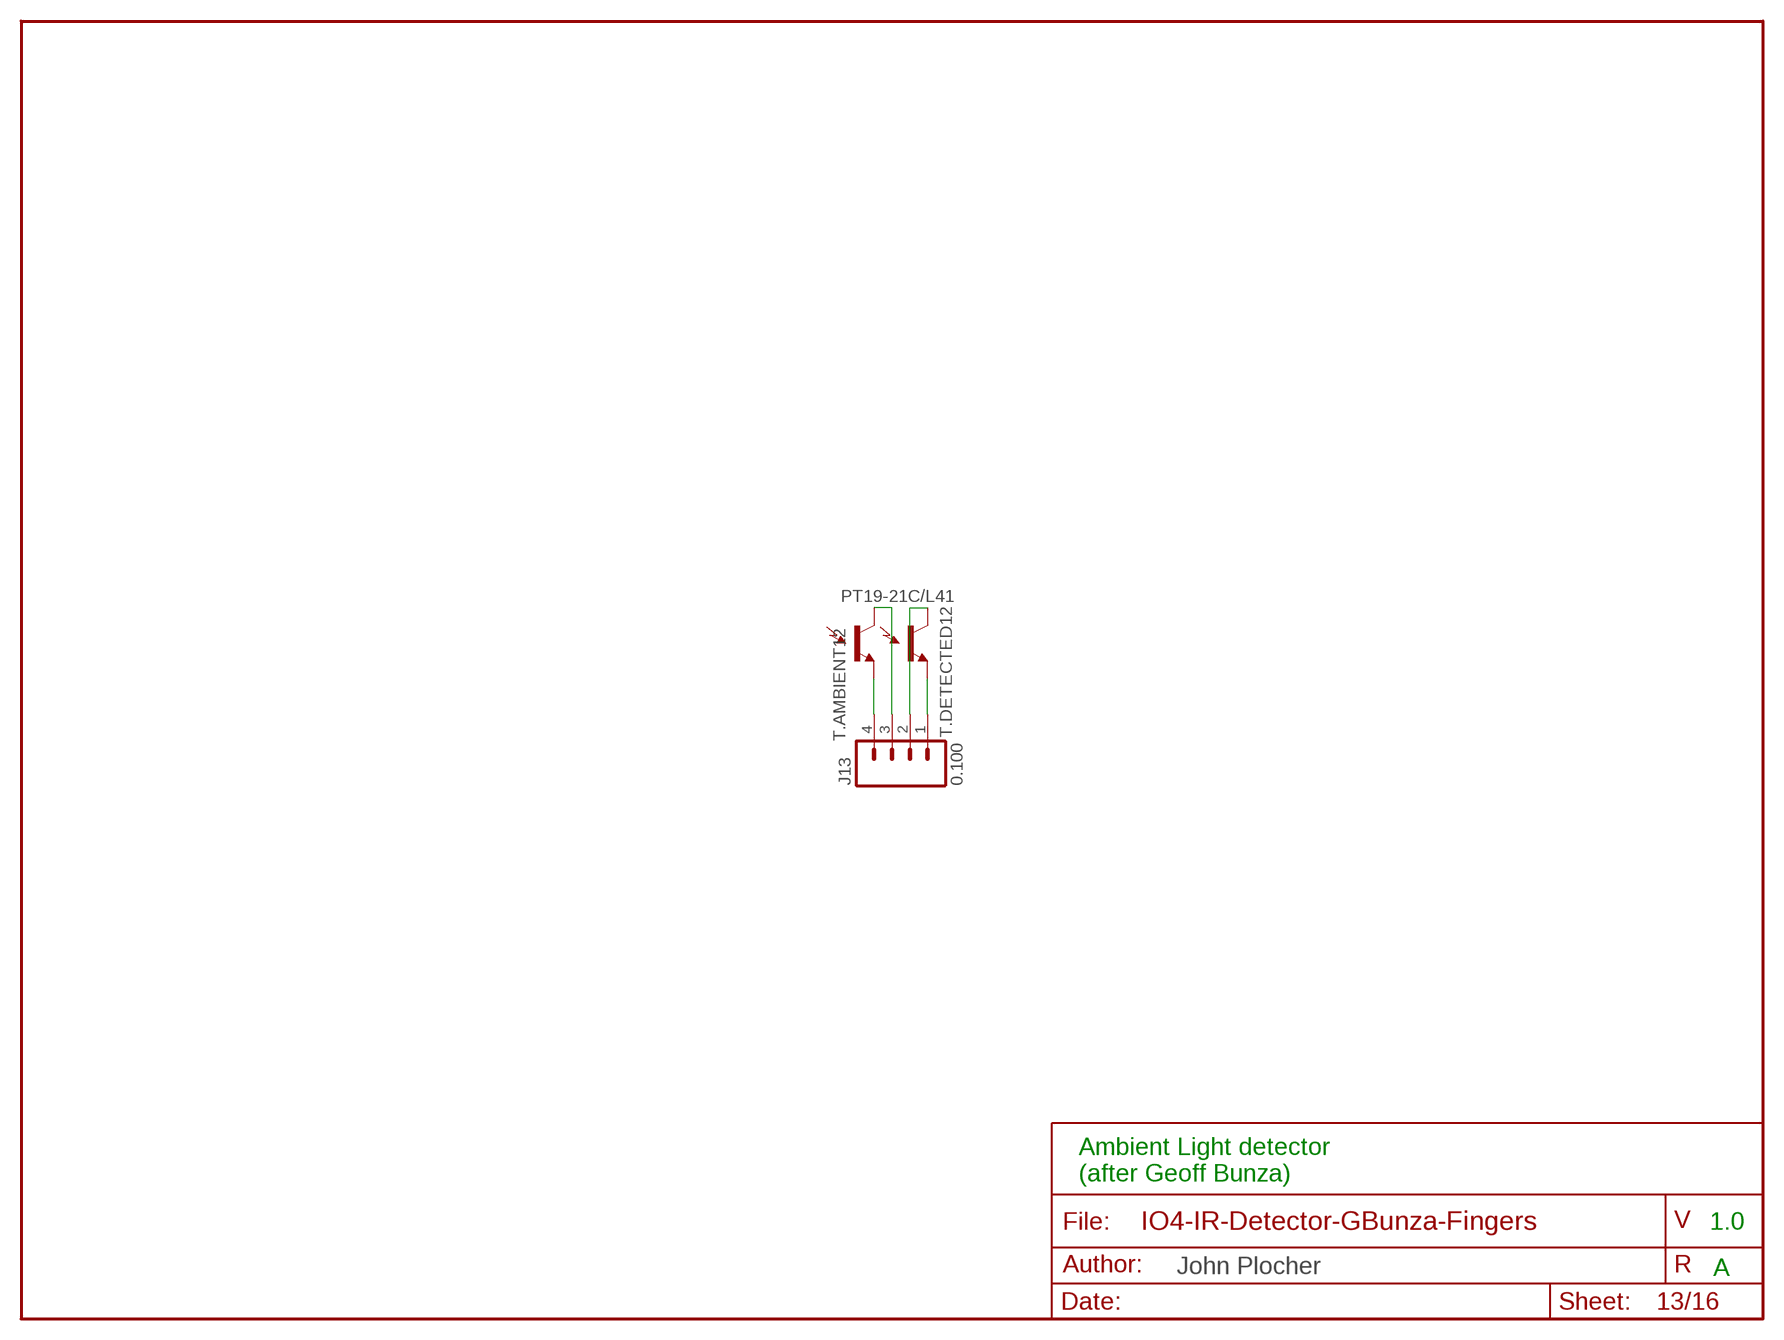
[diagram p12: schematic, sheet 13]

### Parts
J13  0.100  CONNECTOR-M04LOCK  [1X04_LOCK]
T.AMBIENT12  PT19-21C/L41  LIGHTSENSORALS  [ALS-PT19]
T.DETECTED12  PT19-21C/L41  LIGHTSENSORALS  [ALS-PT19]

### Nets
N$49: J13.4 T.AMBIENT12.E(E1)
N$50: J13.1 T.DETECTED12.E(E1)
N$51: J13.2 T.DETECTED12.C(C1)
N$52: J13.3 T.AMBIENT12.C(C1)

### Notes on the sheet
- Ambient Light detector
  (after Geoff Bunza)
- 1.0
- A

## Sheet 14 of 16
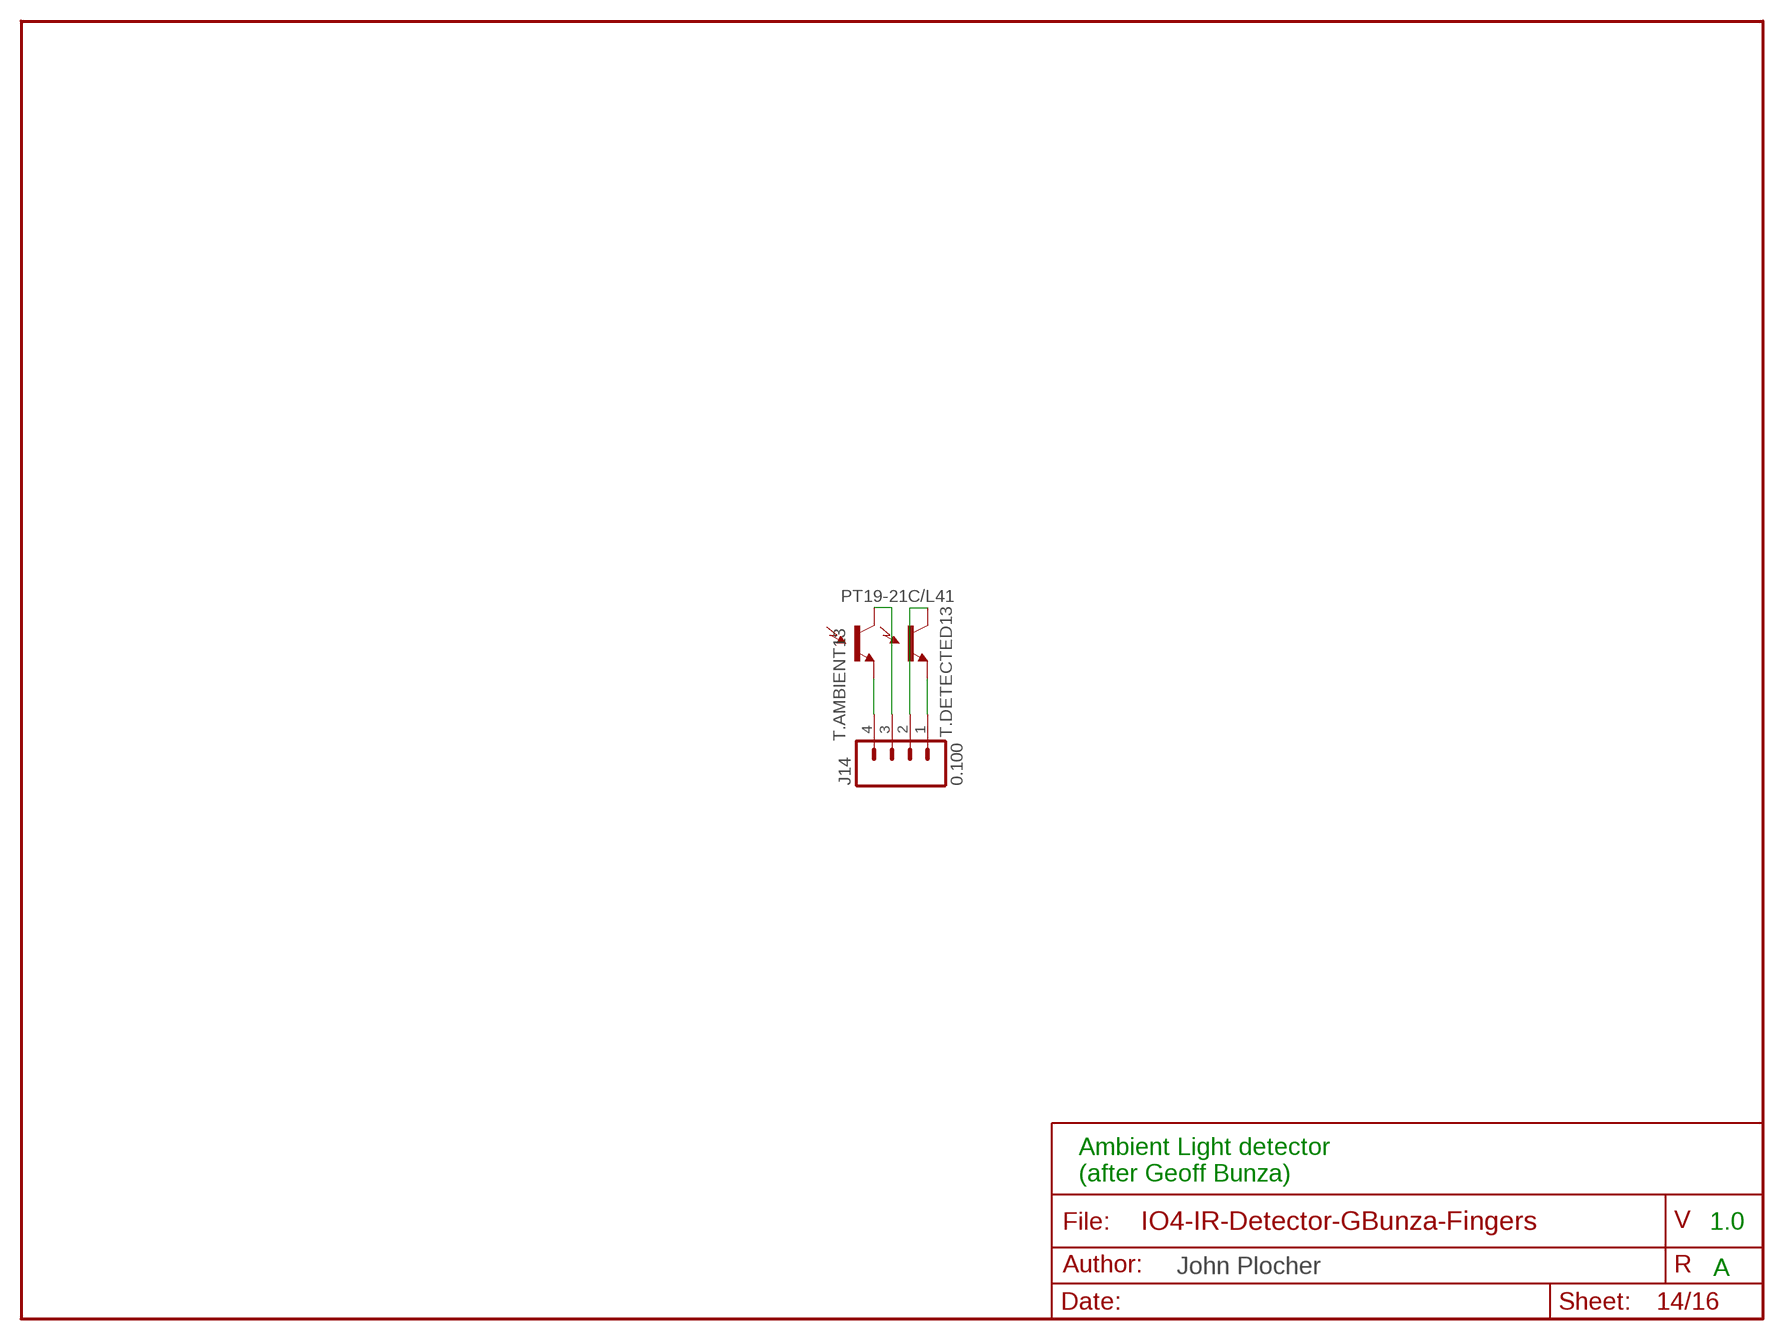
[diagram p13: schematic, sheet 14]

### Parts
J14  0.100  CONNECTOR-M04LOCK  [1X04_LOCK]
T.AMBIENT13  PT19-21C/L41  LIGHTSENSORALS  [ALS-PT19]
T.DETECTED13  PT19-21C/L41  LIGHTSENSORALS  [ALS-PT19]

### Nets
N$53: J14.4 T.AMBIENT13.E(E1)
N$54: J14.1 T.DETECTED13.E(E1)
N$55: J14.2 T.DETECTED13.C(C1)
N$56: J14.3 T.AMBIENT13.C(C1)

### Notes on the sheet
- Ambient Light detector
  (after Geoff Bunza)
- 1.0
- A

## Sheet 15 of 16
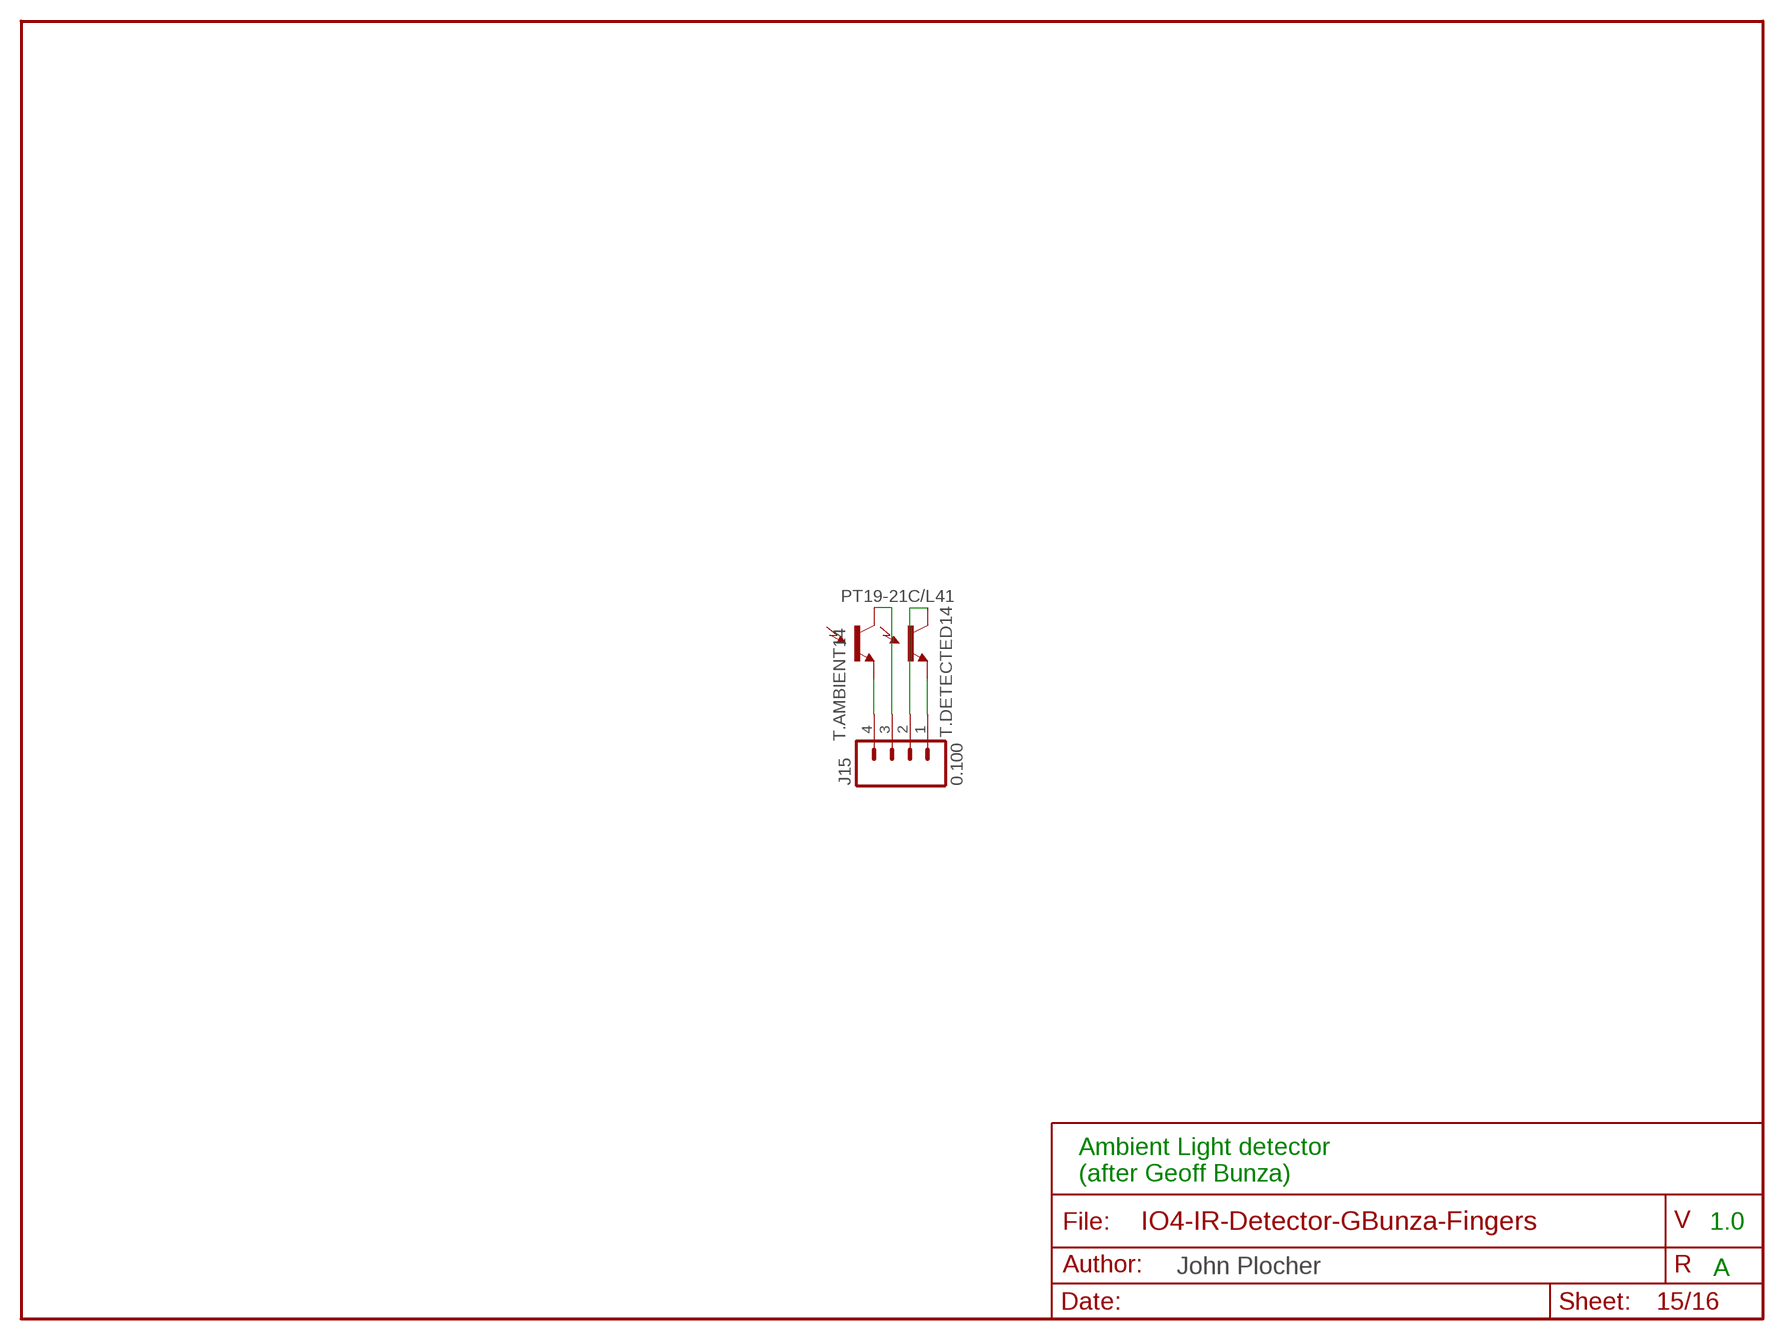
[diagram p14: schematic, sheet 15]

### Parts
J15  0.100  CONNECTOR-M04LOCK  [1X04_LOCK]
T.AMBIENT14  PT19-21C/L41  LIGHTSENSORALS  [ALS-PT19]
T.DETECTED14  PT19-21C/L41  LIGHTSENSORALS  [ALS-PT19]

### Nets
N$57: J15.4 T.AMBIENT14.E(E1)
N$58: J15.1 T.DETECTED14.E(E1)
N$59: J15.2 T.DETECTED14.C(C1)
N$60: J15.3 T.AMBIENT14.C(C1)

### Notes on the sheet
- Ambient Light detector
  (after Geoff Bunza)
- 1.0
- A

## Sheet 16 of 16
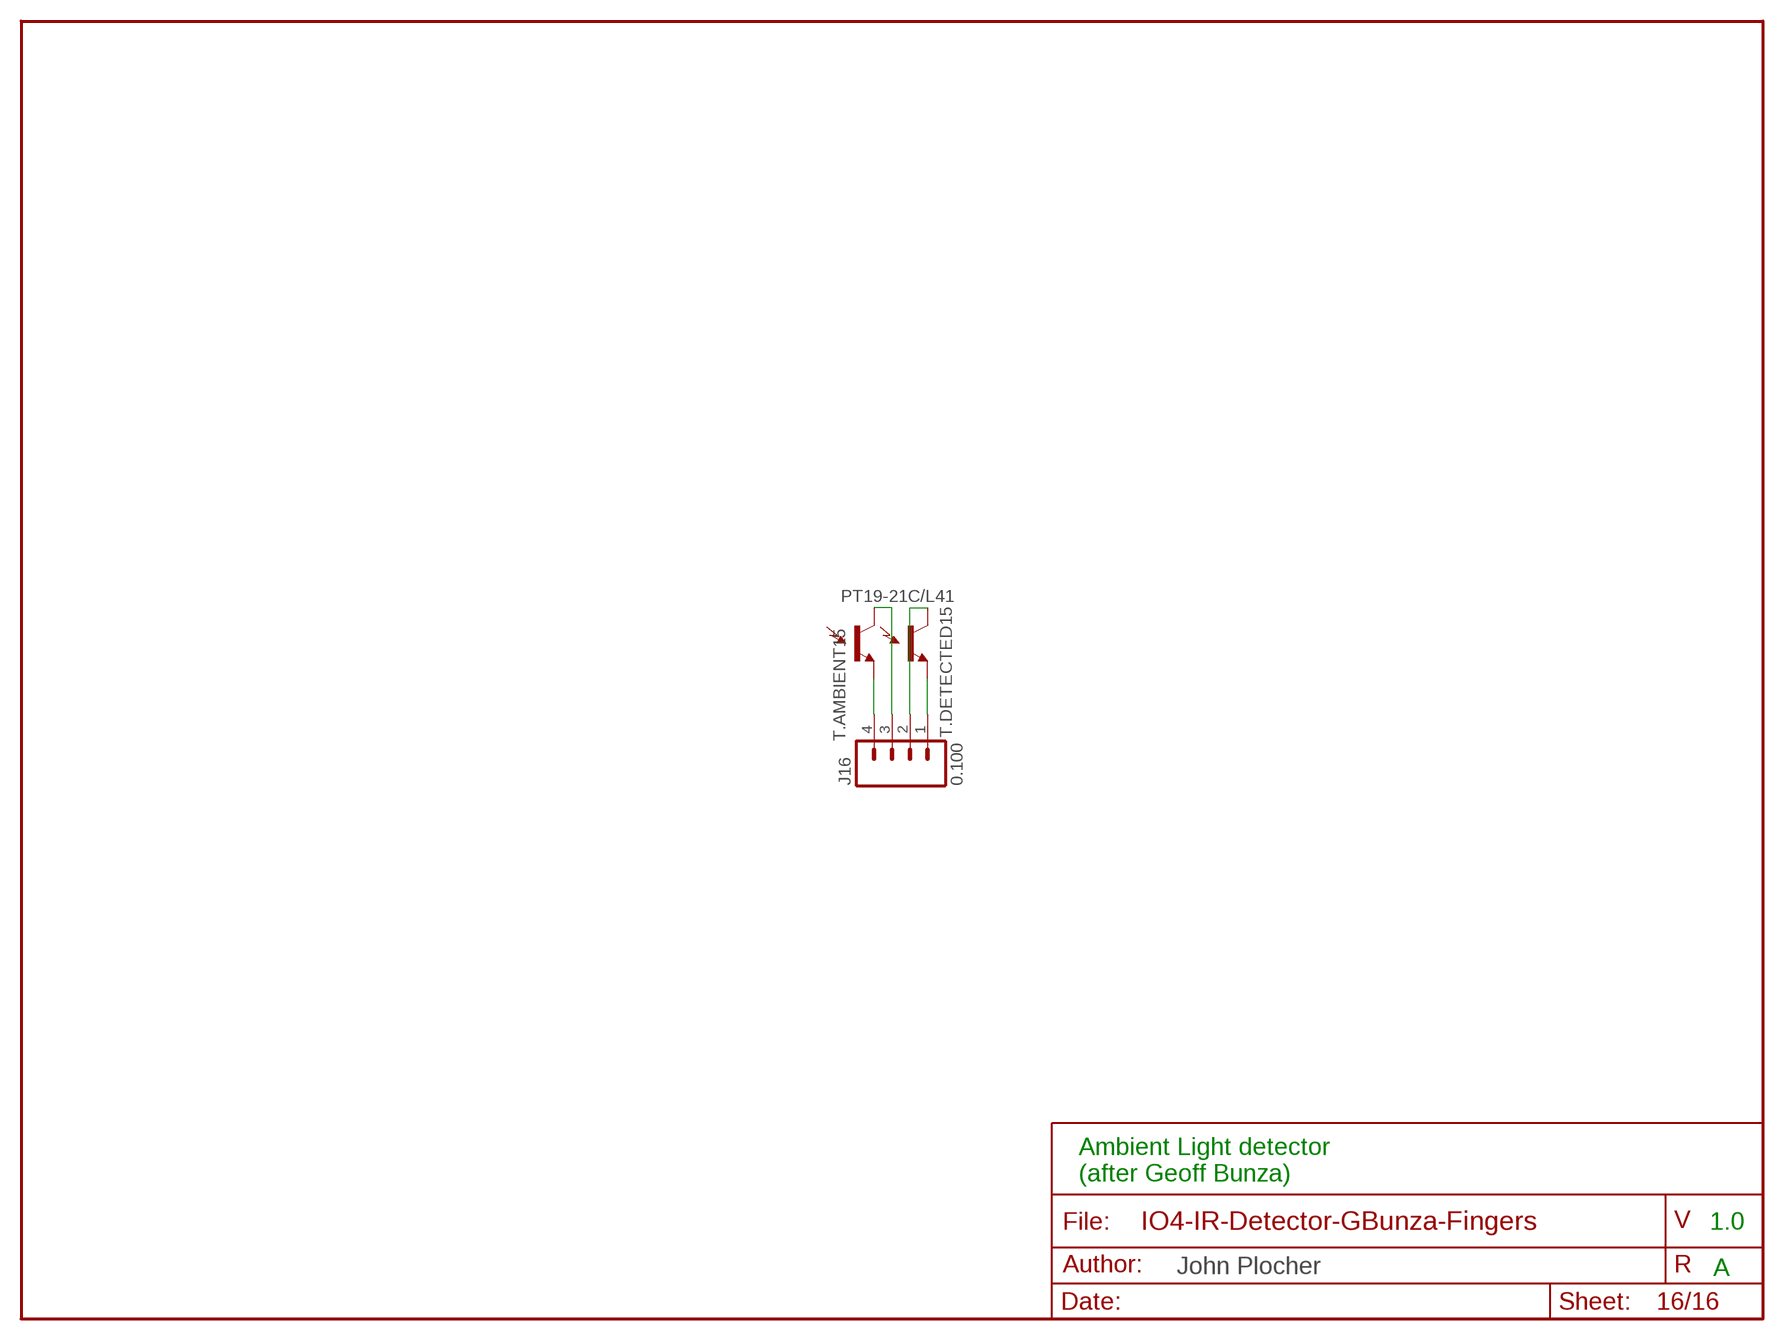
[diagram p15: schematic, sheet 16]

### Parts
J16  0.100  CONNECTOR-M04LOCK  [1X04_LOCK]
T.AMBIENT15  PT19-21C/L41  LIGHTSENSORALS  [ALS-PT19]
T.DETECTED15  PT19-21C/L41  LIGHTSENSORALS  [ALS-PT19]

### Nets
N$61: J16.4 T.AMBIENT15.E(E1)
N$62: J16.1 T.DETECTED15.E(E1)
N$63: J16.2 T.DETECTED15.C(C1)
N$64: J16.3 T.AMBIENT15.C(C1)

### Notes on the sheet
- Ambient Light detector
  (after Geoff Bunza)
- 1.0
- A

## Library data of the parts
J1-J16 = SPCoast:CONNECTOR-M04: Header 4 Standard 4-pin 0.1" header. Use with straight break away headers (SKU : PRT-00116), right angle break away headers (PRT-00553), swiss pins (PRT-00743), machine pins (PRT-00117), and female headers (PRT-00115). Molex polarized connector foot print use with SKU : PRT-08231 with associated crimp pins and housings. 1MM SMD Version SKU: PRT-10208
T.AMBIENT T.AMBIENT1-T.AMBIENT15 T.DETECTED T.DETECTED1-T.DETECTED15 = SparkFun-Sensors:LIGHTSENSOR: Ambient Light Sensor Simple light detection sensor. Output varies with light intensity input. Spark Fun Electronics SKU : COM-08348; PROD_ID: IC-11836

## Board
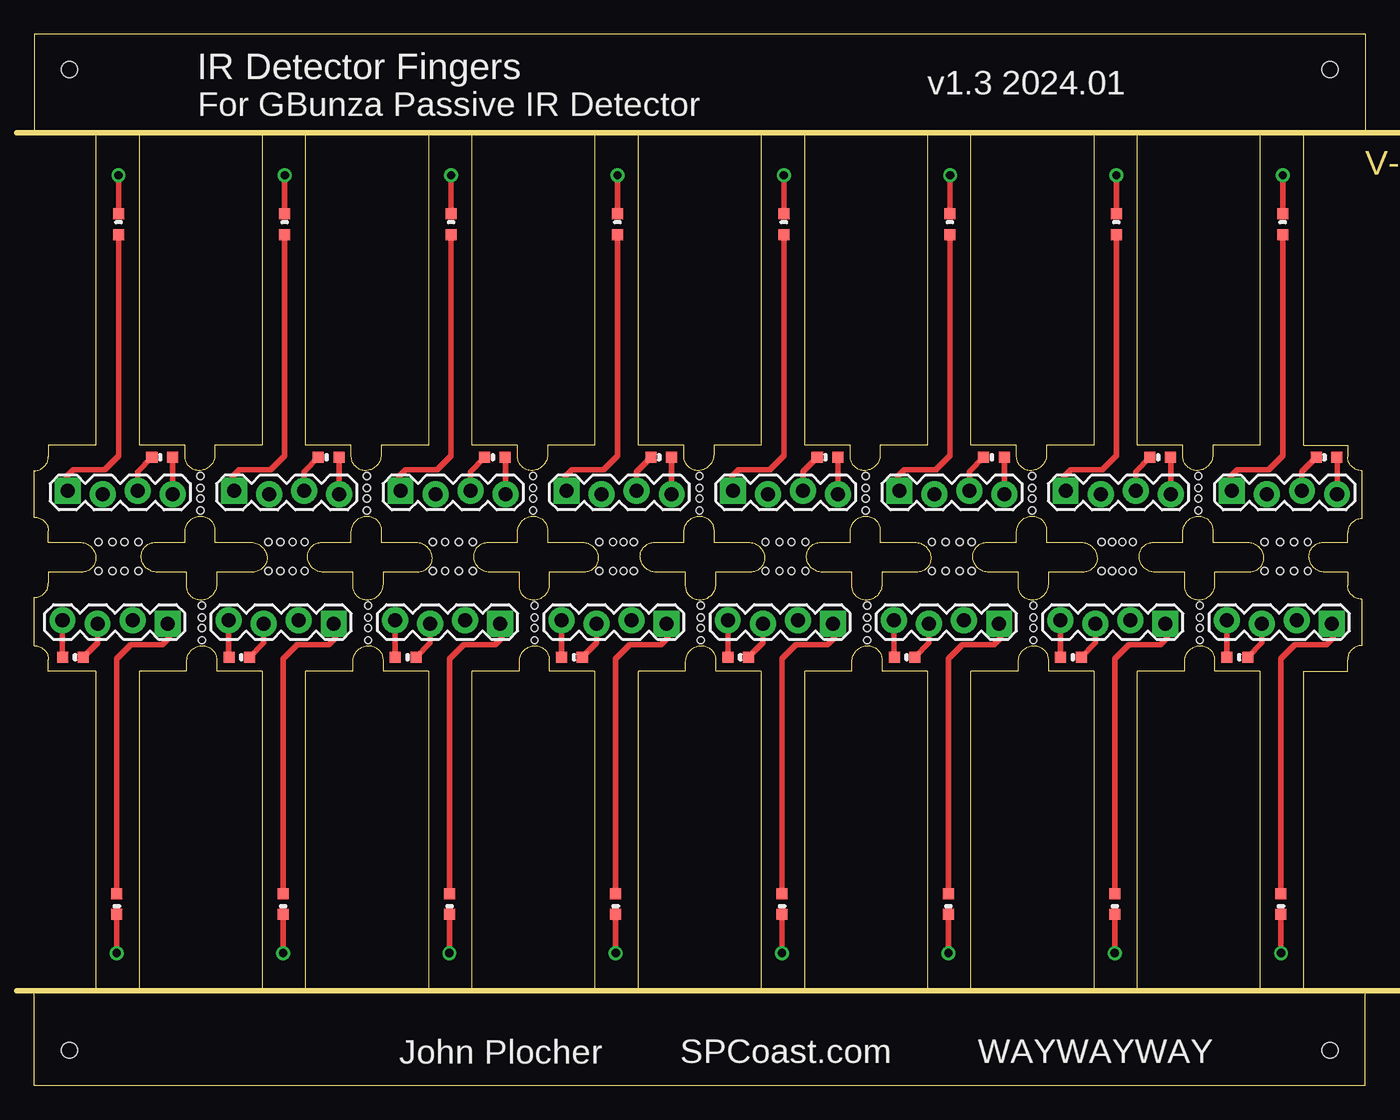
[diagram p16: board, top side]
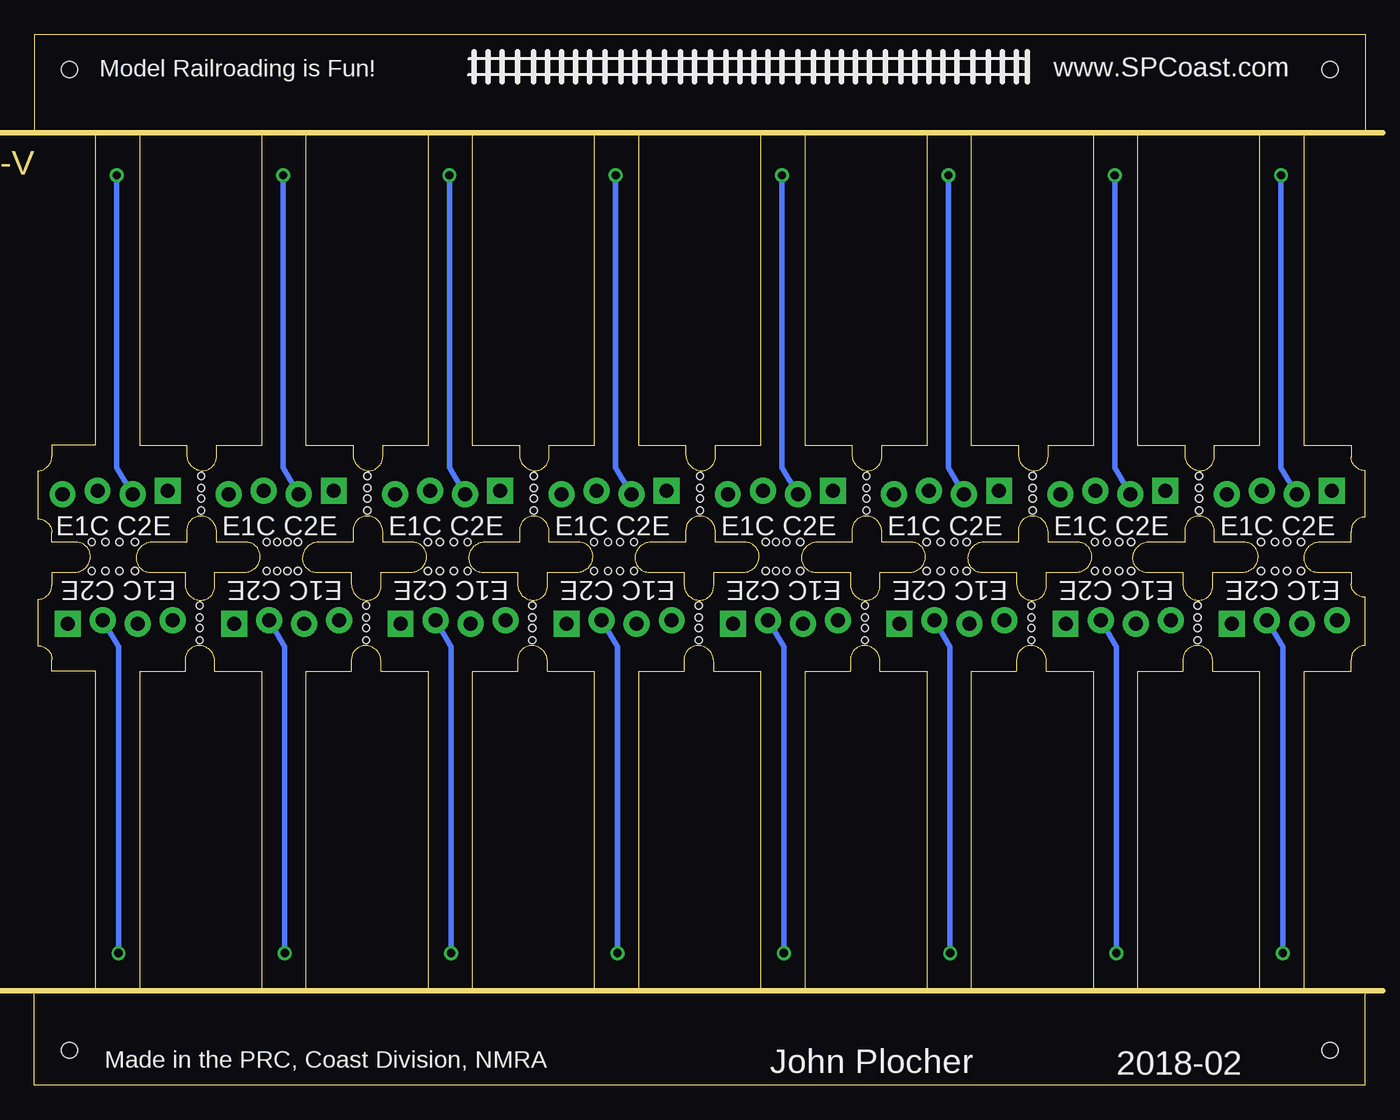
[diagram p17: board, bottom side, seen from below]

Size 96.52 x 76.2 mm. Coordinates in mm from the lower left corner, seen from the top.
Outline: 284 segments
Copper layers (1*16): Top 0.035mm / dielectric 1.5mm / Bottom 0.035mm
Design rules "default *": minimum track width 10mil, minimum drill 0.2mm, track to track 0.54mm, track to pad 0.54mm, pad to pad 0.54mm, via to via 10mil, smd to smd 8mil, copper to edge 8mil, drill to drill 8mil, minimum pad ring 10mil, minimum via ring 8mil, stop-mask expansion 4mil, vias tented up to drill 0mil, thermal gap 10mil
Holes 0.5 mm at 5.65,39.4 4.64,39.4 6.53,39.4 7.54,39.4 5.65,37.29 4.64,37.29 6.53,37.29 7.54,37.29 17.84,39.4 16.96,39.4 18.73,39.4 19.6,39.4 17.84,37.29 16.96,37.29 18.73,37.29 19.6,37.29 29.78,39.4 28.9,39.4 30.79,39.4 31.79,39.4 29.78,37.29 28.9,37.29 30.79,37.29 31.79,37.29 41.97,39.4 40.97,39.4 42.73,39.4 43.48,39.4 41.97,37.29 40.97,37.29 42.73,37.29 43.48,37.29 54.04,39.4 53.03,39.4 54.92,39.4 55.92,39.4 54.04,37.29 53.03,37.29 54.92,37.29 55.92,37.29 66.1,39.4 65.1,39.4 67.11,39.4 67.99,39.4 66.1,37.29 65.1,37.29 67.11,37.29 67.99,37.29 78.17,39.4 77.42,39.4 78.92,39.4 79.67,39.4 78.17,37.29 77.42,37.29 78.92,37.29 79.67,37.29 90.36,39.4 89.23,39.4 91.37,39.4 92.37,39.4 90.36,37.29 89.23,37.29 91.37,37.29 92.37,37.29 12.14,33.16 12.14,32.28 12.14,33.91 12.14,34.79 12.04,42.56 12.04,41.68 12.04,43.31 12.04,44.19 24.21,33.16 24.21,32.28 24.21,33.91 24.21,34.79 24.1,42.56 24.1,41.68 24.1,43.31 24.1,44.19 36.27,33.16 36.27,32.28 36.27,33.91 36.27,34.79 36.17,42.56 36.17,41.68 36.17,43.31 36.17,44.19 48.34,33.16 48.34,32.28 48.34,33.91 48.34,34.79 48.23,42.56 48.23,41.68 48.23,43.31 48.23,44.19 60.4,33.16 60.4,32.28 60.4,33.91 60.4,34.79 60.3,42.56 60.3,41.68 60.3,43.31 60.3,44.19 72.47,33.16 72.47,32.28 72.47,33.91 72.47,34.79 72.36,42.56 72.36,41.68 72.36,43.31 72.36,44.19 84.53,33.16 84.53,32.28 84.53,33.91 84.53,34.79 84.43,42.56 84.43,41.68 84.43,43.31 84.43,44.19
Milling: 2 lines

### Footprints (pad centres in the part's own frame; a part is rotated, then mirrored left to right if it is on the bottom)
1X04_LOCK = drill 1.016 pad 1.88 square: 1 0,0.127 | drill 1.016 pad 1.88: 2 2.54,-0.127; 3 5.08,0.127; 4 7.62,-0.127
ALS-PT19 = smd 0.8 x 0.8: C -0.75,0; E 0.75,0
MOUNTINGHOLE-TOOL = hole 1.152: 0,0

### Placement (x,y rotation side)
J1  2.41,42.99 0 top
J2  9.65,33.59 180 top
J3  14.48,42.99 0 top
J4  21.72,33.59 180 top
J5  26.54,42.99 0 top
J6  33.78,33.59 180 top
J7  45.85,33.59 180 top
J8  38.61,42.99 0 top
J9  62.74,42.99 0 top
J10  69.98,33.59 180 top
J11  50.67,42.99 0 top
J12  57.91,33.59 180 top
J13  82.04,33.59 180 top
J14  74.8,42.99 0 top
J15  94.11,33.59 180 top
J16  86.87,42.99 0 top
T.AMBIENT  9.27,45.53 0 top
T.AMBIENT1  2.79,31.05 180 top
T.AMBIENT2  21.34,45.53 0 top
T.AMBIENT3  14.86,31.05 180 top
T.AMBIENT4  33.4,45.53 0 top
T.AMBIENT5  26.92,31.05 180 top
T.AMBIENT6  38.99,31.05 180 top
T.AMBIENT7  45.47,45.53 0 top
T.AMBIENT8  69.6,45.53 0 top
T.AMBIENT9  63.12,31.05 180 top
T.AMBIENT10  57.53,45.53 0 top
T.AMBIENT11  51.05,31.05 180 top
T.AMBIENT12  75.18,31.05 180 top
T.AMBIENT13  81.66,45.53 0 top
T.AMBIENT14  87.25,31.05 180 top
T.AMBIENT15  93.73,45.53 0 top
T.DETECTED  6.1,62.44 270 top
T.DETECTED1  5.97,13.14 90 top
T.DETECTED2  18.16,62.44 270 top
T.DETECTED3  18.03,13.14 90 top
T.DETECTED4  30.23,62.44 270 top
T.DETECTED5  30.1,13.14 90 top
T.DETECTED6  42.16,13.14 90 top
T.DETECTED7  42.29,62.44 270 top
T.DETECTED8  66.42,62.44 270 top
T.DETECTED9  66.29,13.14 90 top
T.DETECTED10  54.36,62.44 270 top
T.DETECTED11  54.23,13.14 90 top
T.DETECTED12  78.36,13.14 90 top
T.DETECTED13  78.49,62.44 270 top
T.DETECTED14  90.42,13.14 90 top
T.DETECTED15  90.55,62.44 270 top
U$1  [MOUNTINGHOLE-TOOL]  2.54,73.66 0 top
U$2  [MOUNTINGHOLE-TOOL]  93.98,73.66 0 top
U$3  [MOUNTINGHOLE-TOOL]  2.54,2.54 0 top
U$4  [MOUNTINGHOLE-TOOL]  93.98,2.54 0 top

### Tracks (layer width: path | path; a pad name or v marks a point on that pad's centre or on a via)
N$1
  Top 0.406: T.AMBIENT1.E 2.03,31.06 J2.4
N$2
  Top 0.406: T.DETECTED1.E 5.97,30.92 6.99,31.94 9.27,31.94 9.78,32.45 J2.1
N$3  (via drill 0.6)
  Top 0.406: v5.97,9.59 T.DETECTED1.C
  Bottom 0.406: J2.2 5.97,31.81 v5.97,9.59
N$4
  Top 0.406: T.AMBIENT1.C 4.57,32.08 J2.3
N$5
  Top 0.406: T.AMBIENT2.E 22.1,45.52 J3.4
N$6
  Top 0.406: T.DETECTED2.E 18.16,45.66 17.14,44.64 14.86,44.64 14.35,44.13 J3.1
N$7  (via drill 0.6)
  Top 0.406: v18.16,65.99 T.DETECTED2.C
  Bottom 0.406: J3.2 18.16,44.77 v18.16,65.99
N$8
  Top 0.406: T.AMBIENT2.C 19.56,44.5 J3.3
N$9
  Top 0.406: T.AMBIENT3.E 14.1,31.06 J4.4
N$10
  Top 0.406: T.DETECTED3.E 18.03,30.92 19.05,31.94 21.34,31.94 21.84,32.45 J4.1
N$11  (via drill 0.6)
  Top 0.406: v18.03,9.59 T.DETECTED3.C
  Bottom 0.406: J4.2 18.03,31.81 v18.03,9.59
N$12
  Top 0.406: T.AMBIENT3.C 16.64,32.08 J4.3
N$13
  Top 0.406: T.AMBIENT.E 10.03,45.52 J1.4
N$14
  Top 0.406: T.DETECTED.E 6.1,45.66 5.08,44.64 2.79,44.64 2.29,44.13 J1.1
N$15  (via drill 0.6)
  Top 0.406: v6.1,65.99 T.DETECTED.C
  Bottom 0.406: J1.2 6.1,44.77 v6.1,65.99
N$16
  Top 0.406: T.AMBIENT.C 7.49,44.5 J1.3
N$17
  Top 0.406: T.AMBIENT4.E 34.16,45.52 J5.4
N$18
  Top 0.406: T.DETECTED4.E 30.23,45.66 29.21,44.64 26.92,44.64 26.42,44.13 J5.1
N$19  (via drill 0.6)
  Top 0.406: v30.23,65.99 T.DETECTED4.C
  Bottom 0.406: J5.2 30.23,44.77 v30.23,65.99
N$20
  Top 0.406: T.AMBIENT4.C 31.62,44.5 J5.3
N$21
  Top 0.406: T.AMBIENT5.E 26.16,31.06 J6.4
N$22
  Top 0.406: T.DETECTED5.E 30.1,30.92 31.11,31.94 33.4,31.94 33.91,32.45 J6.1
N$23  (via drill 0.6)
  Top 0.406: v30.1,9.59 T.DETECTED5.C
  Bottom 0.406: J6.2 30.1,31.81 v30.1,9.59
N$24
  Top 0.406: T.AMBIENT5.C 28.7,32.08 J6.3
N$25
  Top 0.406: T.AMBIENT6.E 38.23,31.06 J7.4
N$26
  Top 0.406: T.DETECTED6.E 42.16,30.92 43.18,31.94 45.47,31.94 45.97,32.45 J7.1
N$27  (via drill 0.6)
  Top 0.406: v42.16,9.59 T.DETECTED6.C
  Bottom 0.406: J7.2 42.16,31.81 v42.16,9.59
N$28
  Top 0.406: T.AMBIENT6.C 40.77,32.08 J7.3
N$29
  Top 0.406: T.AMBIENT7.E 46.23,45.52 J8.4
N$30
  Top 0.406: T.DETECTED7.E 42.29,45.66 41.27,44.64 38.99,44.64 38.48,44.13 J8.1
N$31  (via drill 0.6)
  Top 0.406: v42.29,65.99 T.DETECTED7.C
  Bottom 0.406: J8.2 42.29,44.77 v42.29,65.99
N$32
  Top 0.406: T.AMBIENT7.C 43.69,44.5 J8.3
N$33
  Top 0.406: T.AMBIENT8.E 70.36,45.52 J9.4
N$34
  Top 0.406: T.DETECTED8.E 66.42,45.66 65.41,44.64 63.12,44.64 62.61,44.13 J9.1
N$35  (via drill 0.6)
  Top 0.406: v66.42,65.99 T.DETECTED8.C
  Bottom 0.406: J9.2 66.42,44.77 v66.42,65.99
N$36
  Top 0.406: T.AMBIENT8.C 67.82,44.5 J9.3
N$37
  Top 0.406: T.AMBIENT9.E 62.36,31.06 J10.4
N$38
  Top 0.406: T.DETECTED9.E 66.29,30.92 67.31,31.94 69.6,31.94 70.1,32.45 J10.1
N$39  (via drill 0.6)
  Top 0.406: v66.29,9.59 T.DETECTED9.C
  Bottom 0.406: J10.2 66.29,31.81 v66.29,9.59
N$40
  Top 0.406: T.AMBIENT9.C 64.9,32.08 J10.3
N$41
  Top 0.406: T.AMBIENT10.E 58.29,45.52 J11.4
N$42
  Top 0.406: T.DETECTED10.E 54.36,45.66 53.34,44.64 51.05,44.64 50.55,44.13 J11.1
N$43  (via drill 0.6)
  Top 0.406: v54.36,65.99 T.DETECTED10.C
  Bottom 0.406: J11.2 54.36,44.77 v54.36,65.99
N$44
  Top 0.406: T.AMBIENT10.C 55.75,44.5 J11.3
N$45
  Top 0.406: T.AMBIENT11.E 50.29,31.06 J12.4
N$46
  Top 0.406: T.DETECTED11.E 54.23,30.92 55.24,31.94 57.53,31.94 58.04,32.45 J12.1
N$47  (via drill 0.6)
  Top 0.406: v54.23,9.59 T.DETECTED11.C
  Bottom 0.406: J12.2 54.23,31.81 v54.23,9.59
N$48
  Top 0.406: T.AMBIENT11.C 52.83,32.08 J12.3
N$49
  Top 0.406: T.AMBIENT12.E 74.42,31.06 J13.4
N$50
  Top 0.406: T.DETECTED12.E 78.36,30.92 79.38,31.94 81.66,31.94 82.17,32.45 J13.1
N$51  (via drill 0.6)
  Top 0.406: v78.36,9.59 T.DETECTED12.C
  Bottom 0.406: J13.2 78.36,31.81 v78.36,9.59
N$52
  Top 0.406: T.AMBIENT12.C 76.96,32.08 J13.3
N$53
  Top 0.406: T.AMBIENT13.E 82.42,45.52 J14.4
N$54
  Top 0.406: T.DETECTED13.E 78.49,45.66 77.47,44.64 75.18,44.64 74.68,44.13 J14.1
N$55  (via drill 0.6)
  Top 0.406: v78.49,65.99 T.DETECTED13.C
  Bottom 0.406: J14.2 78.49,44.77 v78.49,65.99
N$56
  Top 0.406: T.AMBIENT13.C 79.88,44.5 J14.3
N$57
  Top 0.406: T.AMBIENT14.E 86.49,31.06 J15.4
N$58
  Top 0.406: T.DETECTED14.E 90.42,30.92 91.44,31.94 93.73,31.94 94.23,32.45 J15.1
N$59  (via drill 0.6)
  Top 0.406: v90.42,9.59 T.DETECTED14.C
  Bottom 0.406: J15.2 90.42,31.81 v90.42,9.59
N$60
  Top 0.406: T.AMBIENT14.C 89.03,32.08 J15.3
N$61
  Top 0.406: T.AMBIENT15.E 94.49,45.52 J16.4
N$62
  Top 0.406: T.DETECTED15.E 90.55,45.66 89.53,44.64 87.25,44.64 86.74,44.13 J16.1
N$63  (via drill 0.6)
  Top 0.406: v90.55,65.99 T.DETECTED15.C
  Bottom 0.406: J16.2 90.55,44.77 v90.55,65.99
N$64
  Top 0.406: T.AMBIENT15.C 91.95,44.5 J16.3

### Text on the board
tPlace: IR Detector Fingers | v1.3 2024.01 | For GBunza Passive IR Detector | John Plocher | SPCoast.com | WAYWAYWAY
bPlace: www.SPCoast.com | Model Railroading is Fun! | E1C C2E | E1C C2E | E1C C2E | E1C C2E | E1C C2E | E1C C2E | E1C C2E | E1C C2E | E1C C2E | E1C C2E | E1C C2E | E1C C2E | E1C C2E | E1C C2E | E1C C2E | E1C C2E | 2018-02 | John Plocher | Made in the PRC, Coast Division, NMRA
Milling: V-score | V-score
Measures: HO / / Midpoint / / N / / / Track | Track / / / N / / Midpoint / / HO